# EAGLE schematic serv_open8_rohm (EAGLE 9.6.2)
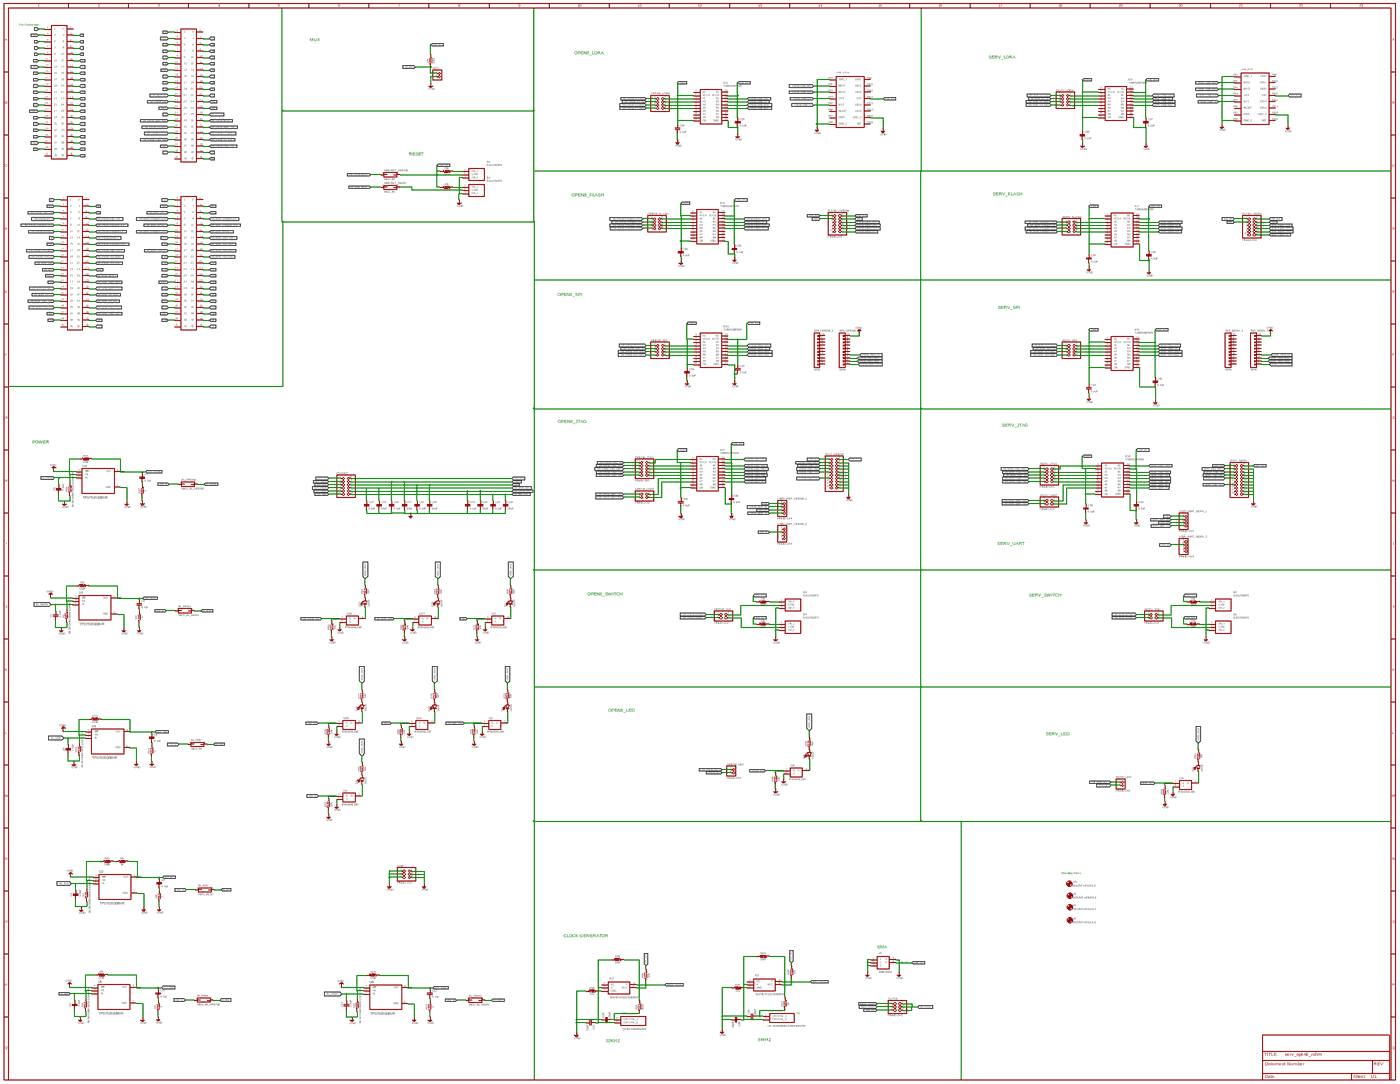
[diagram p0: schematic, sheet 1, overview]
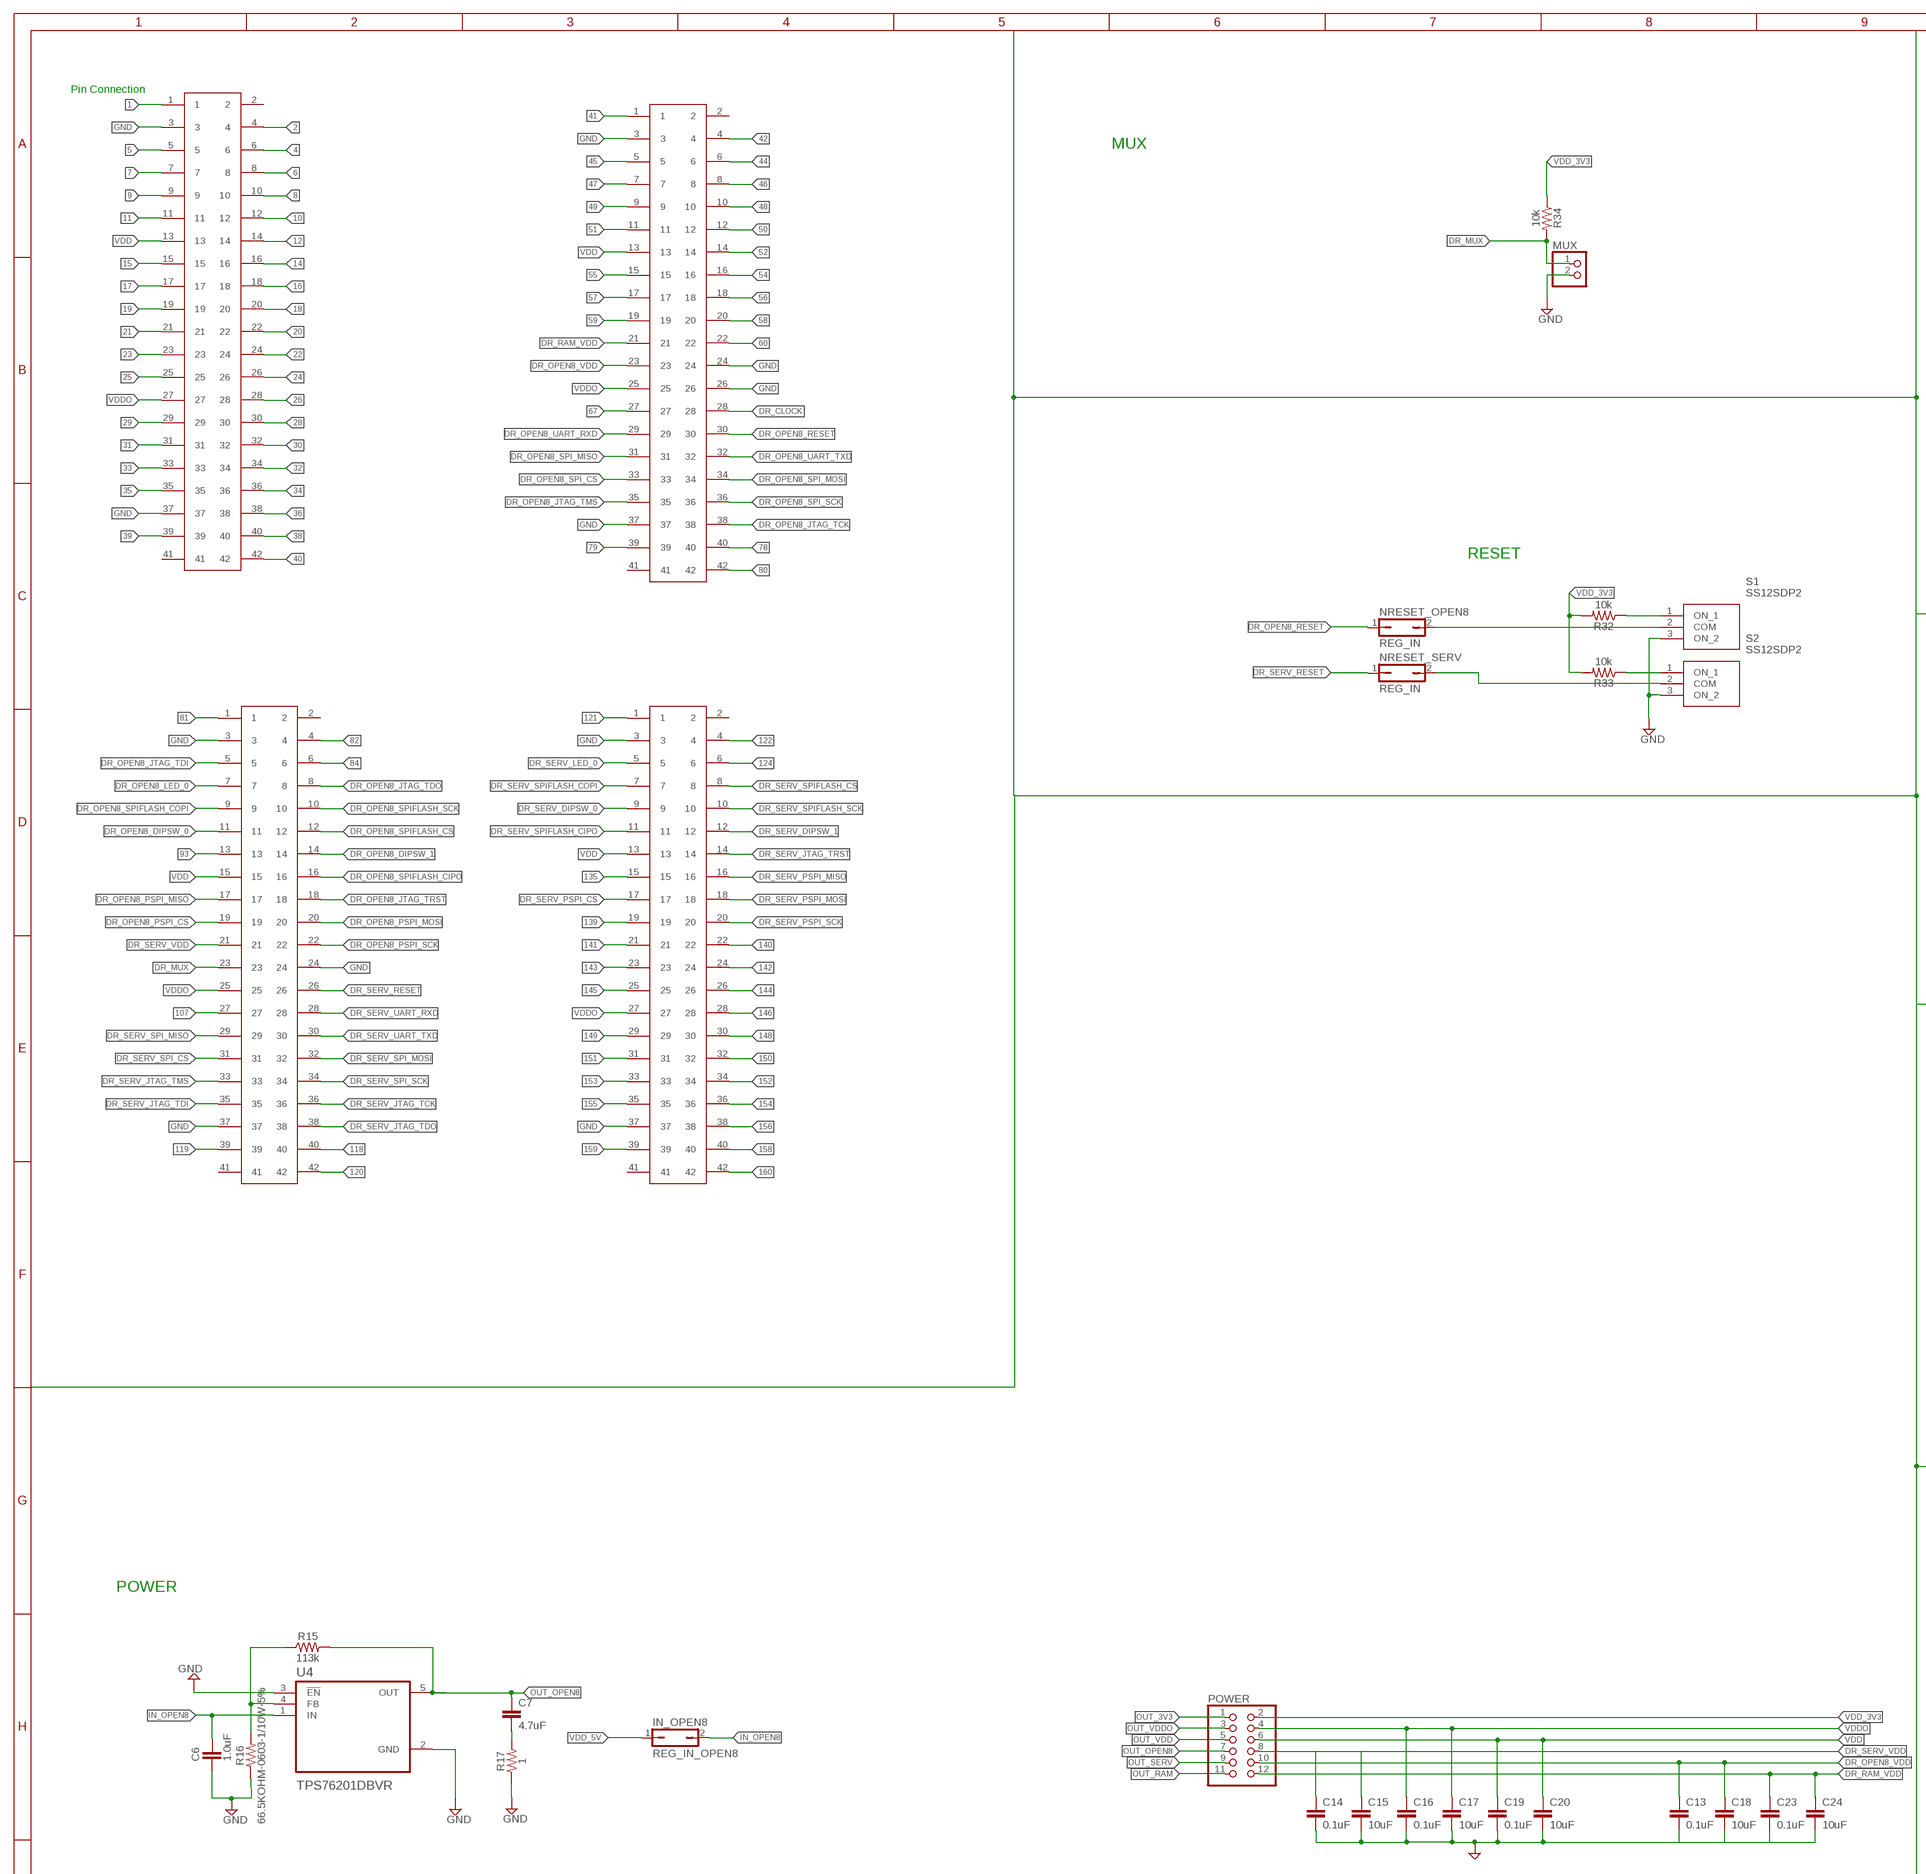
[diagram p1: schematic, sheet 1, part 1 of 6]
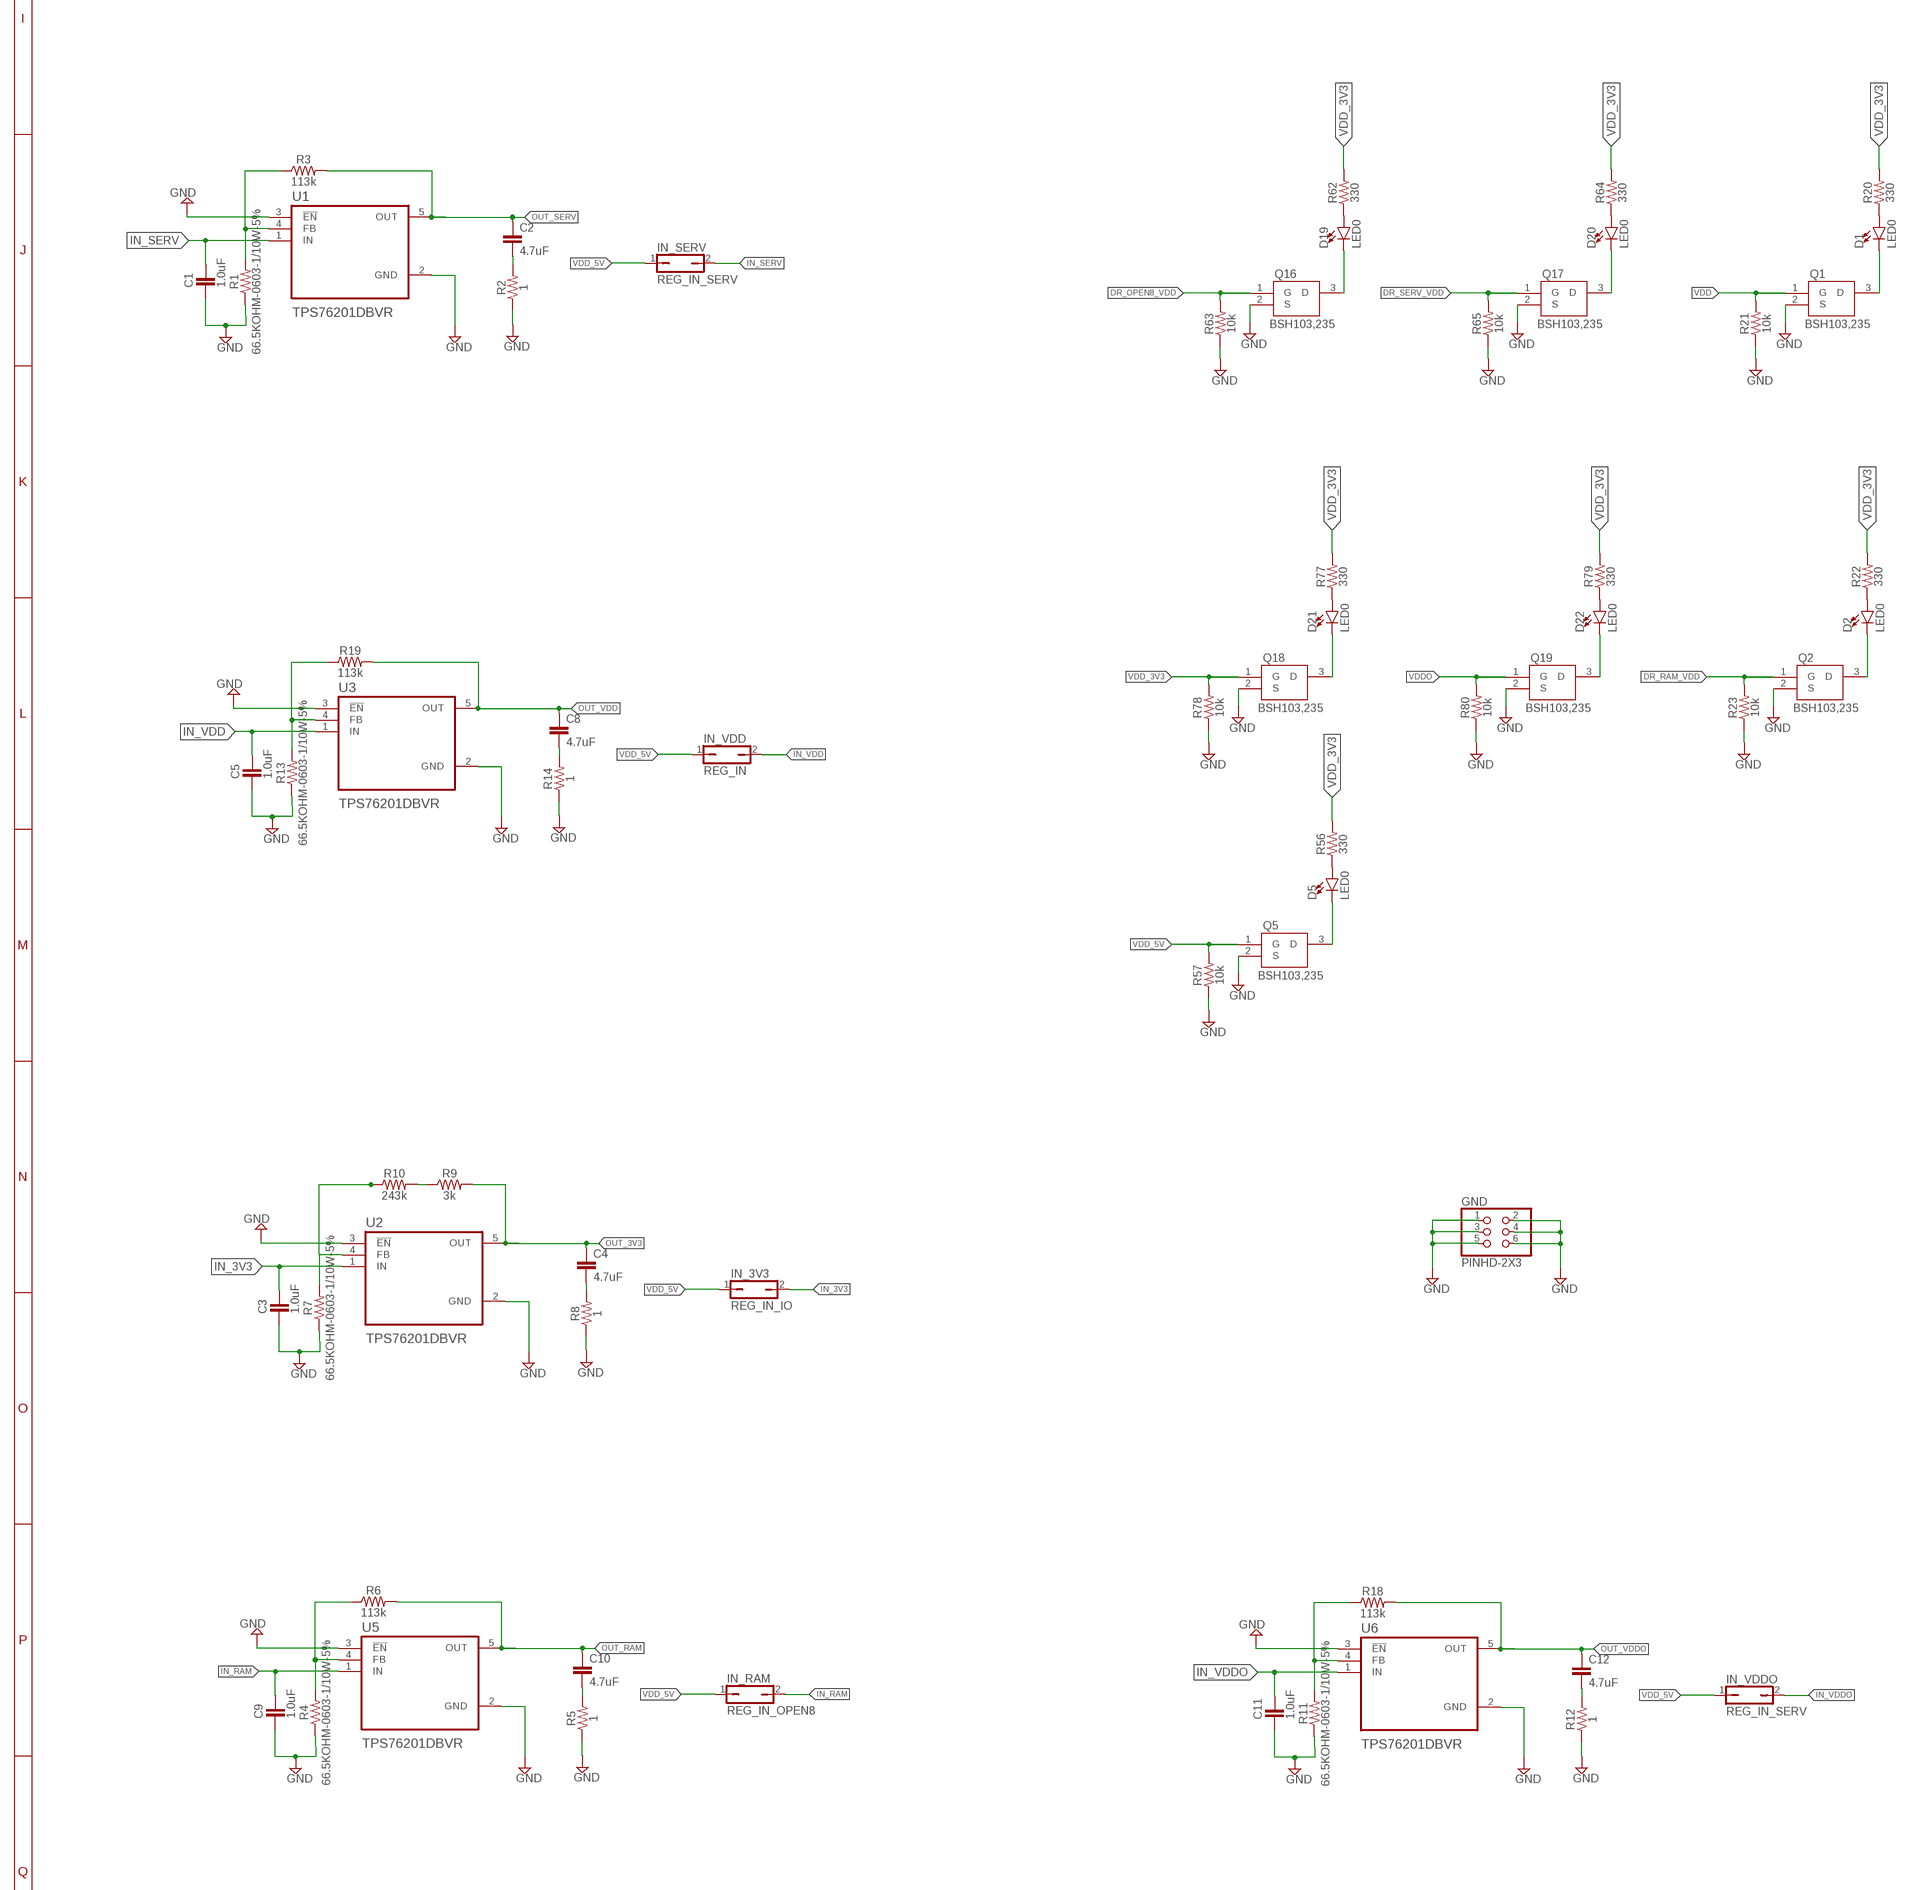
[diagram p2: schematic, sheet 1, part 2 of 6]
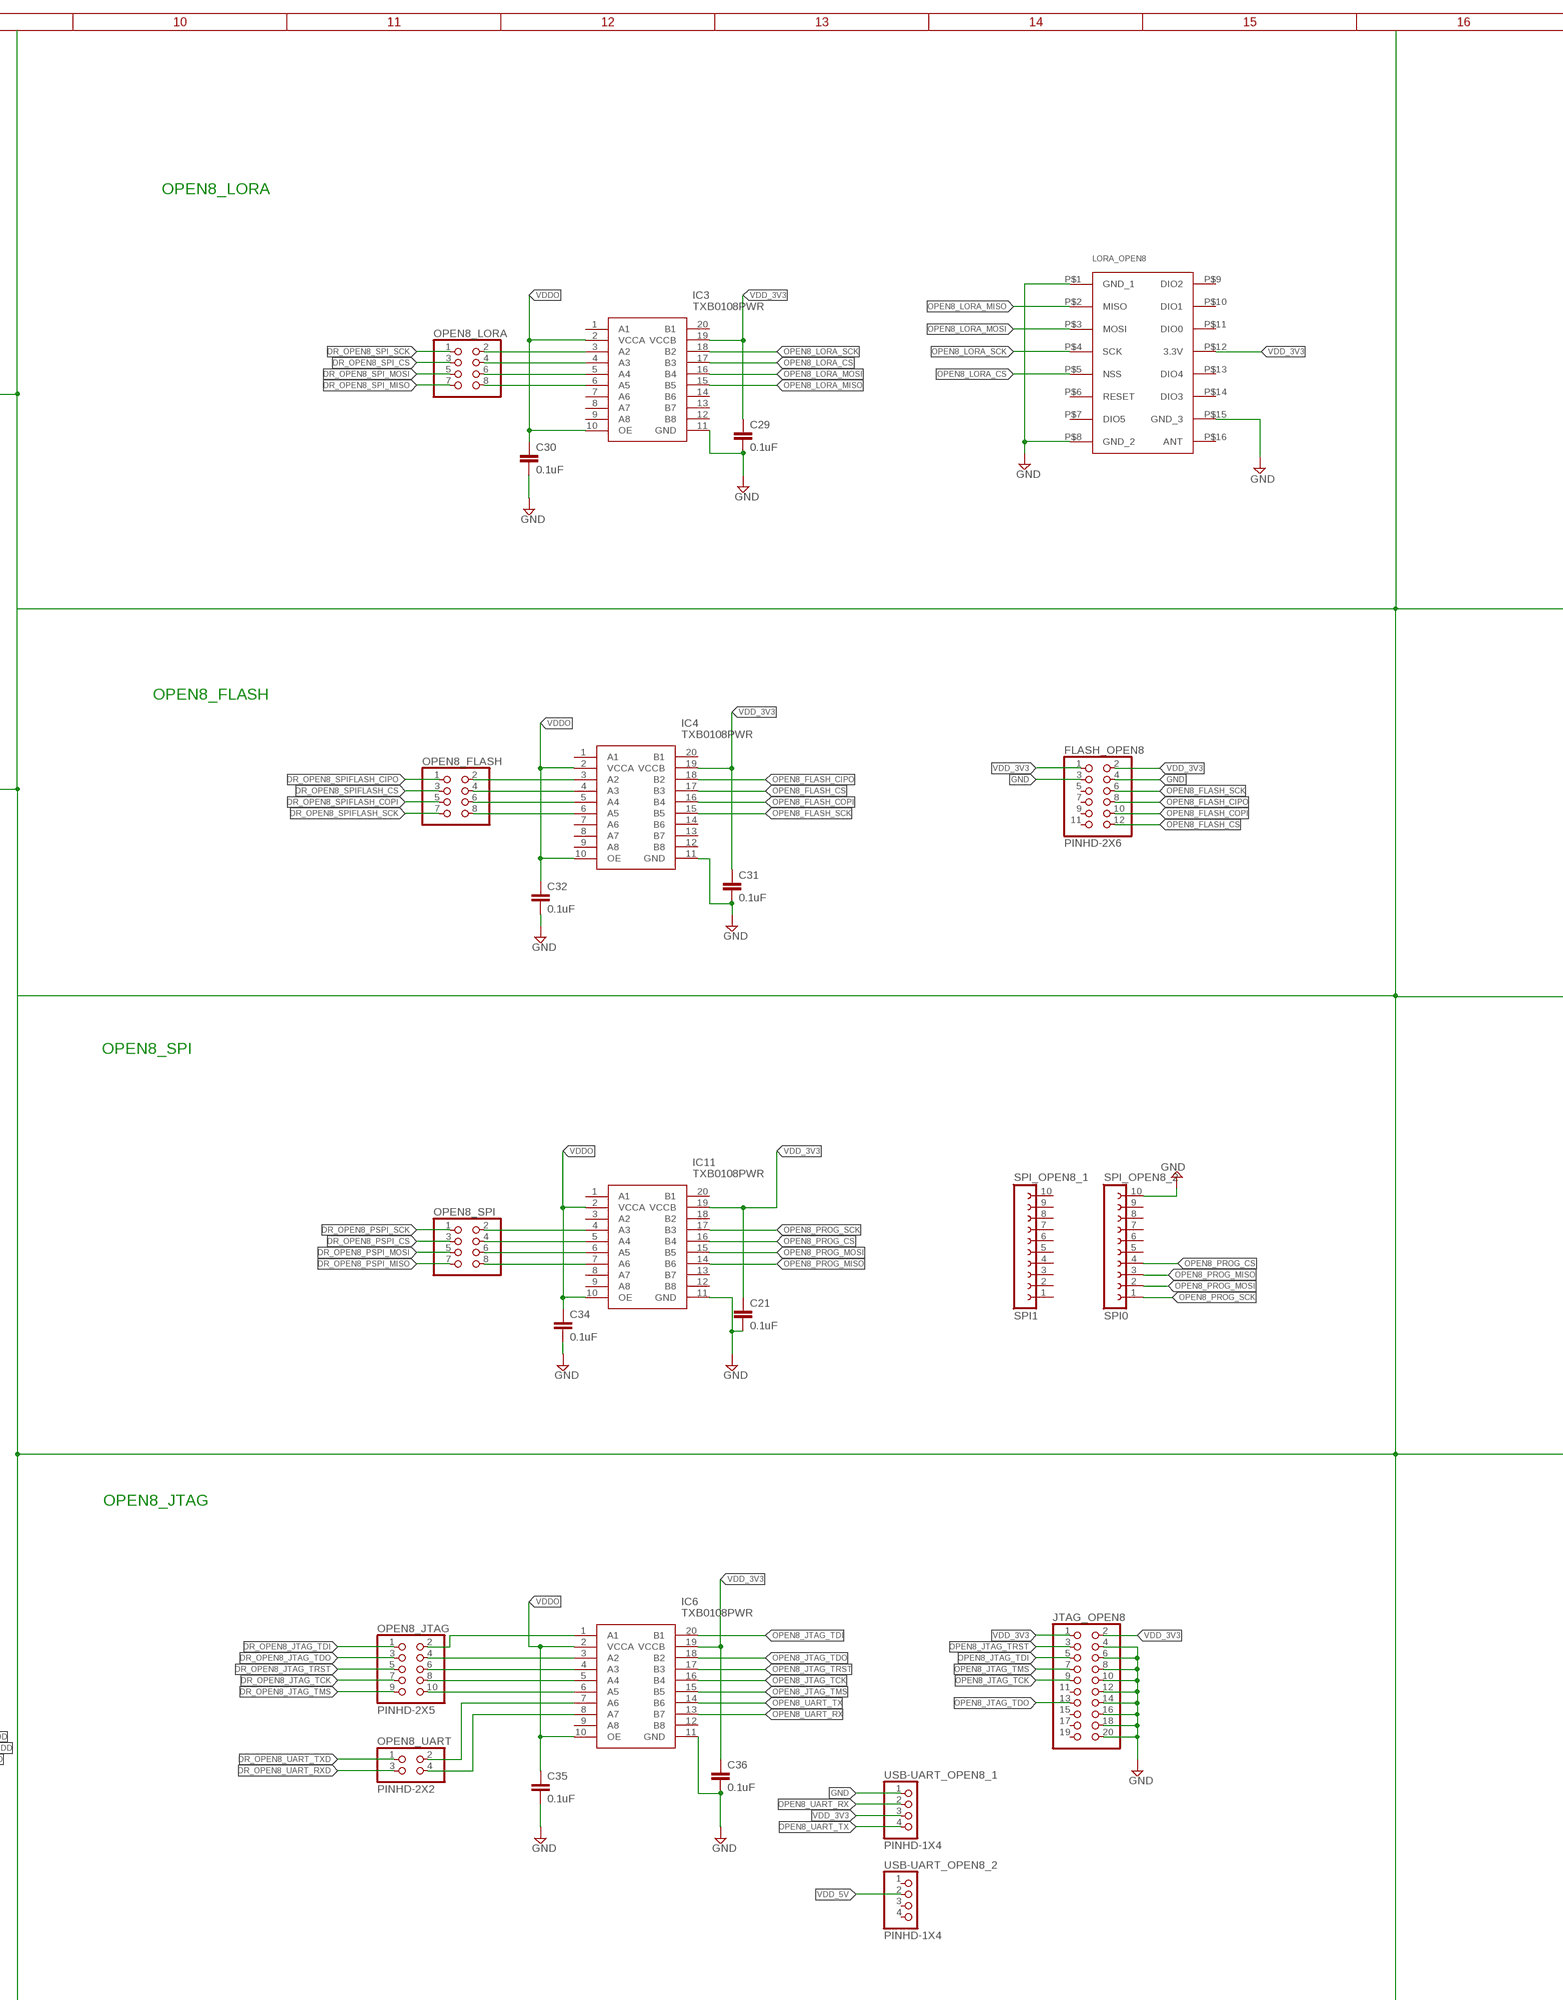
[diagram p3: schematic, sheet 1, part 3 of 6]
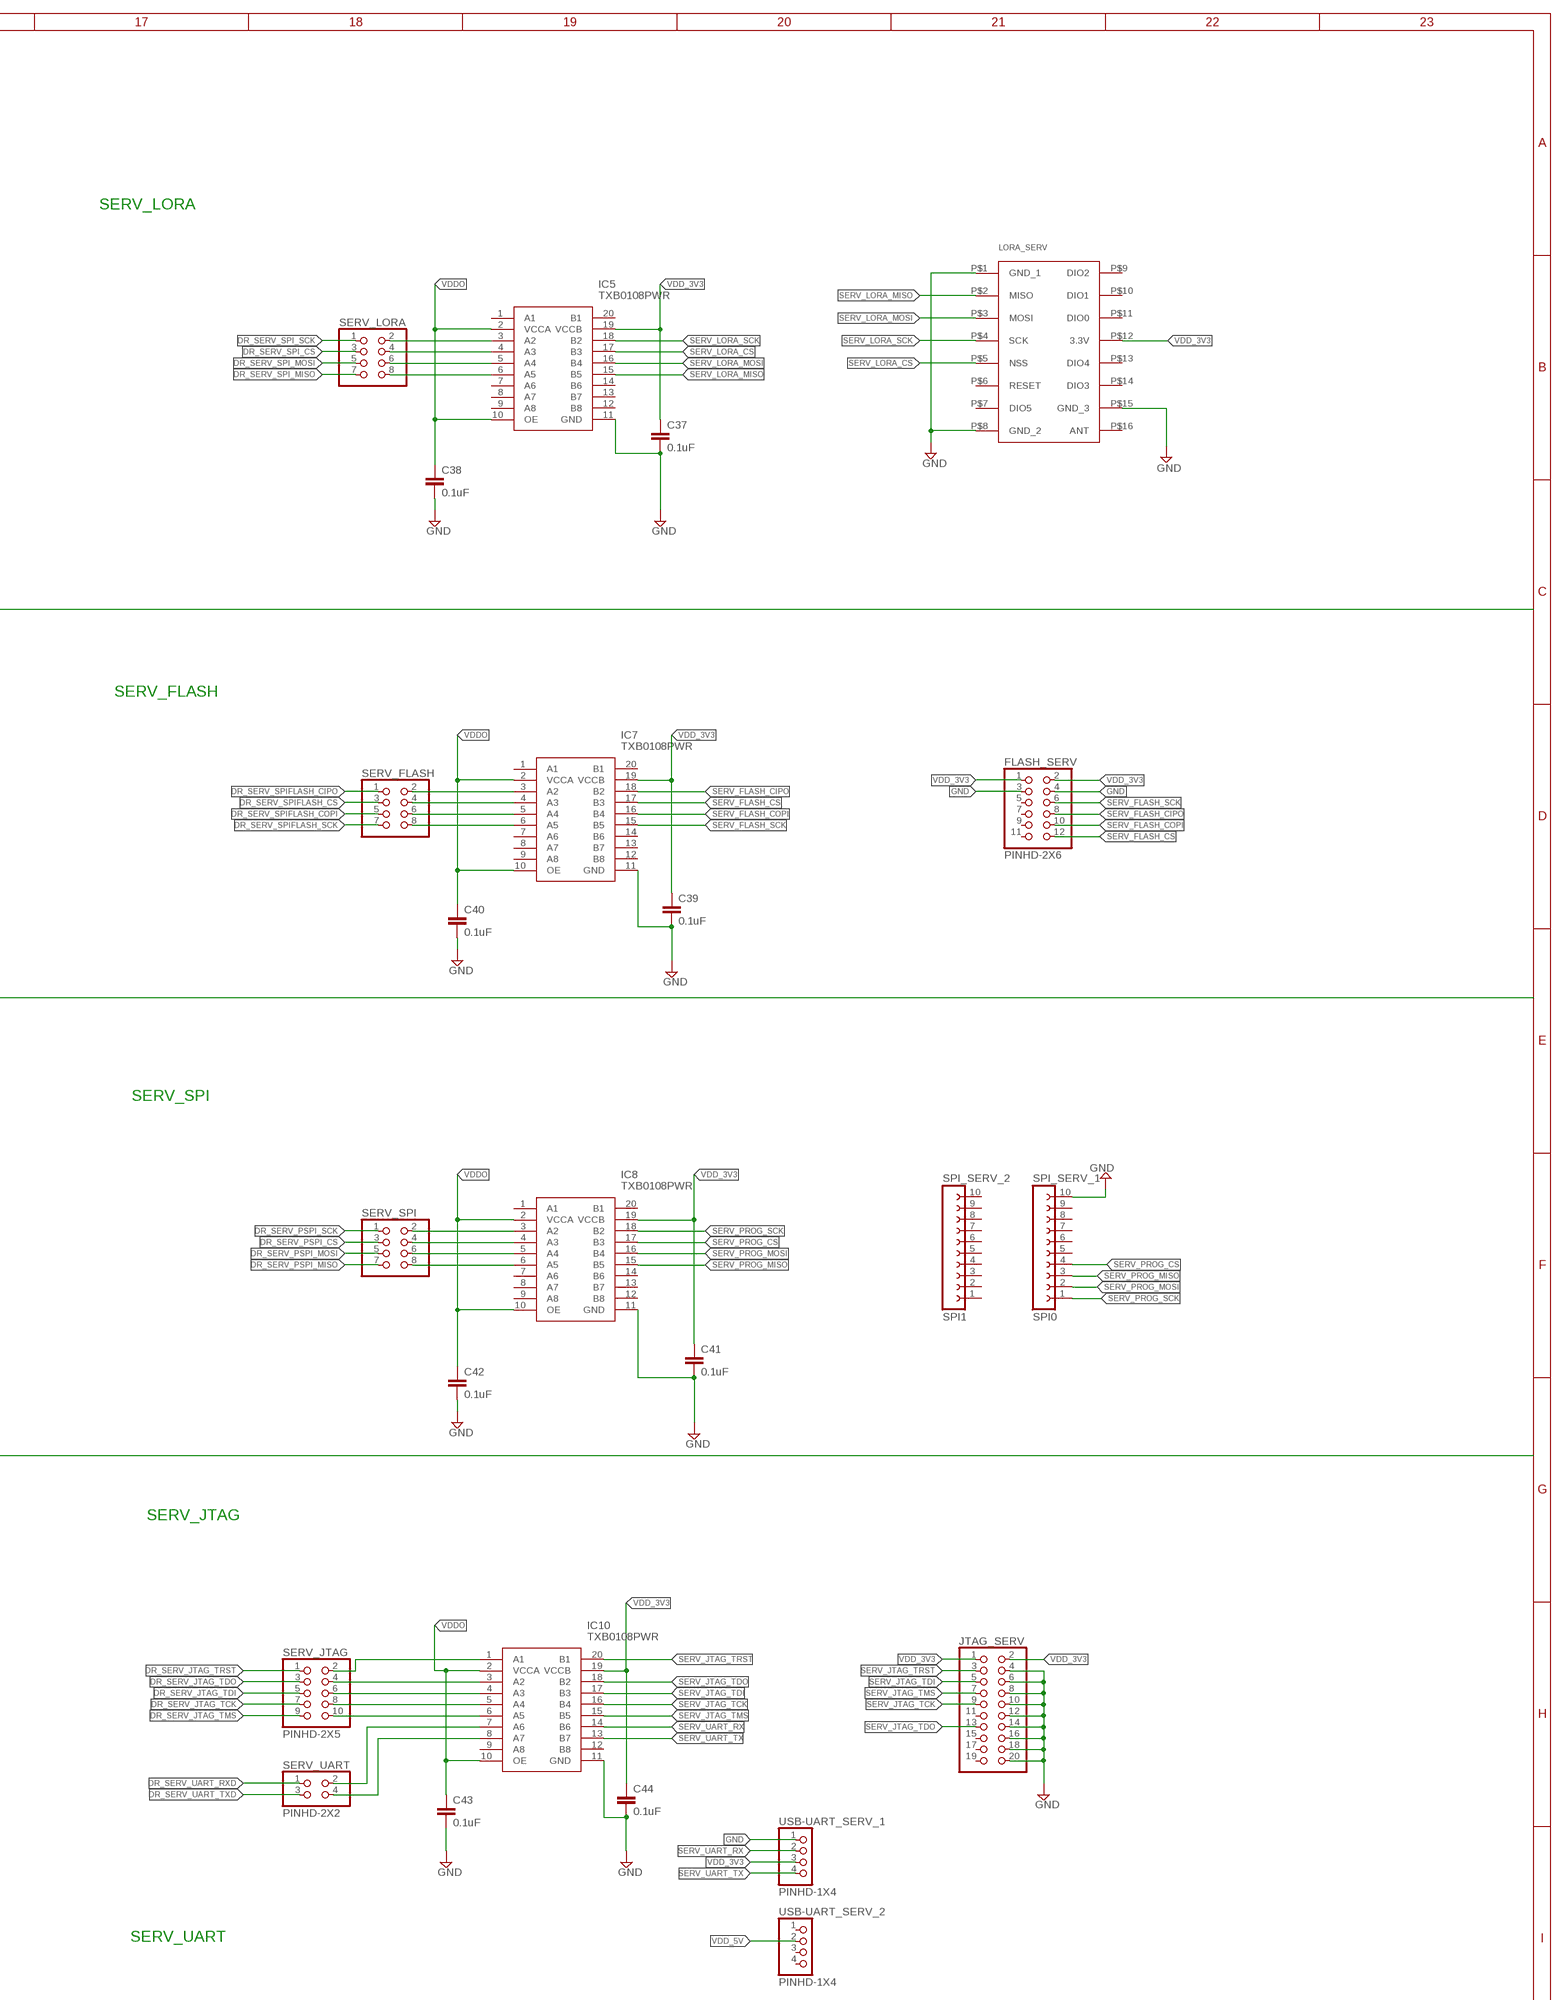
[diagram p4: schematic, sheet 1, part 4 of 6]
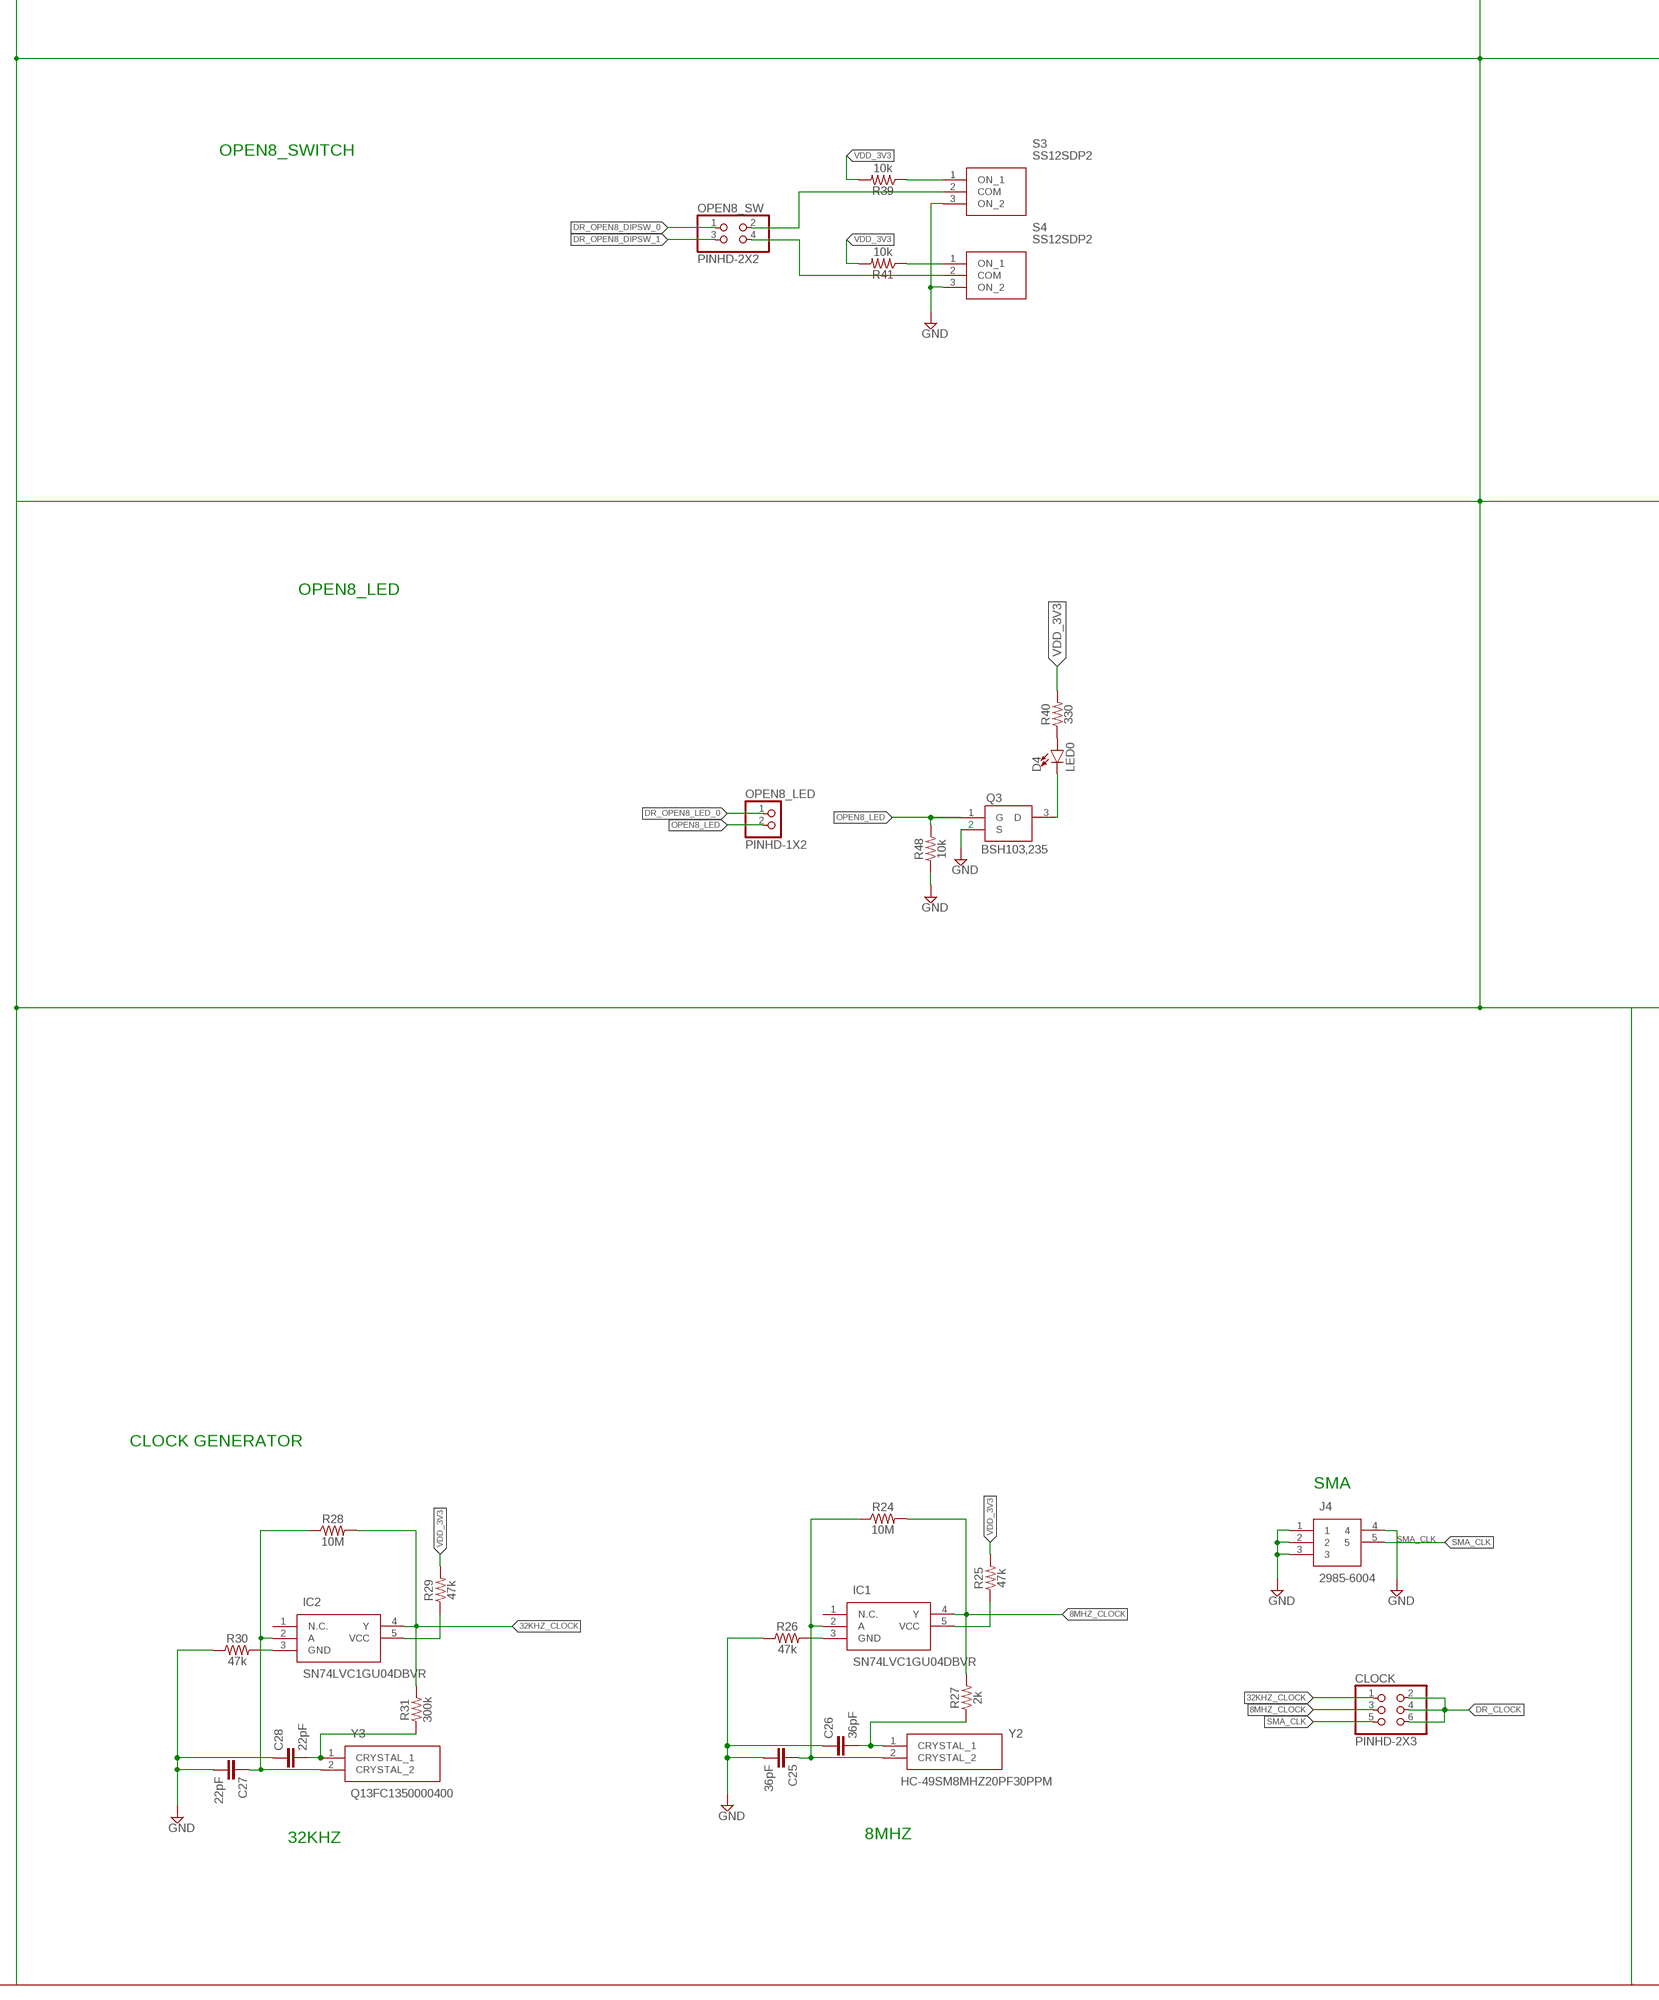
[diagram p5: schematic, sheet 1, part 5 of 6]
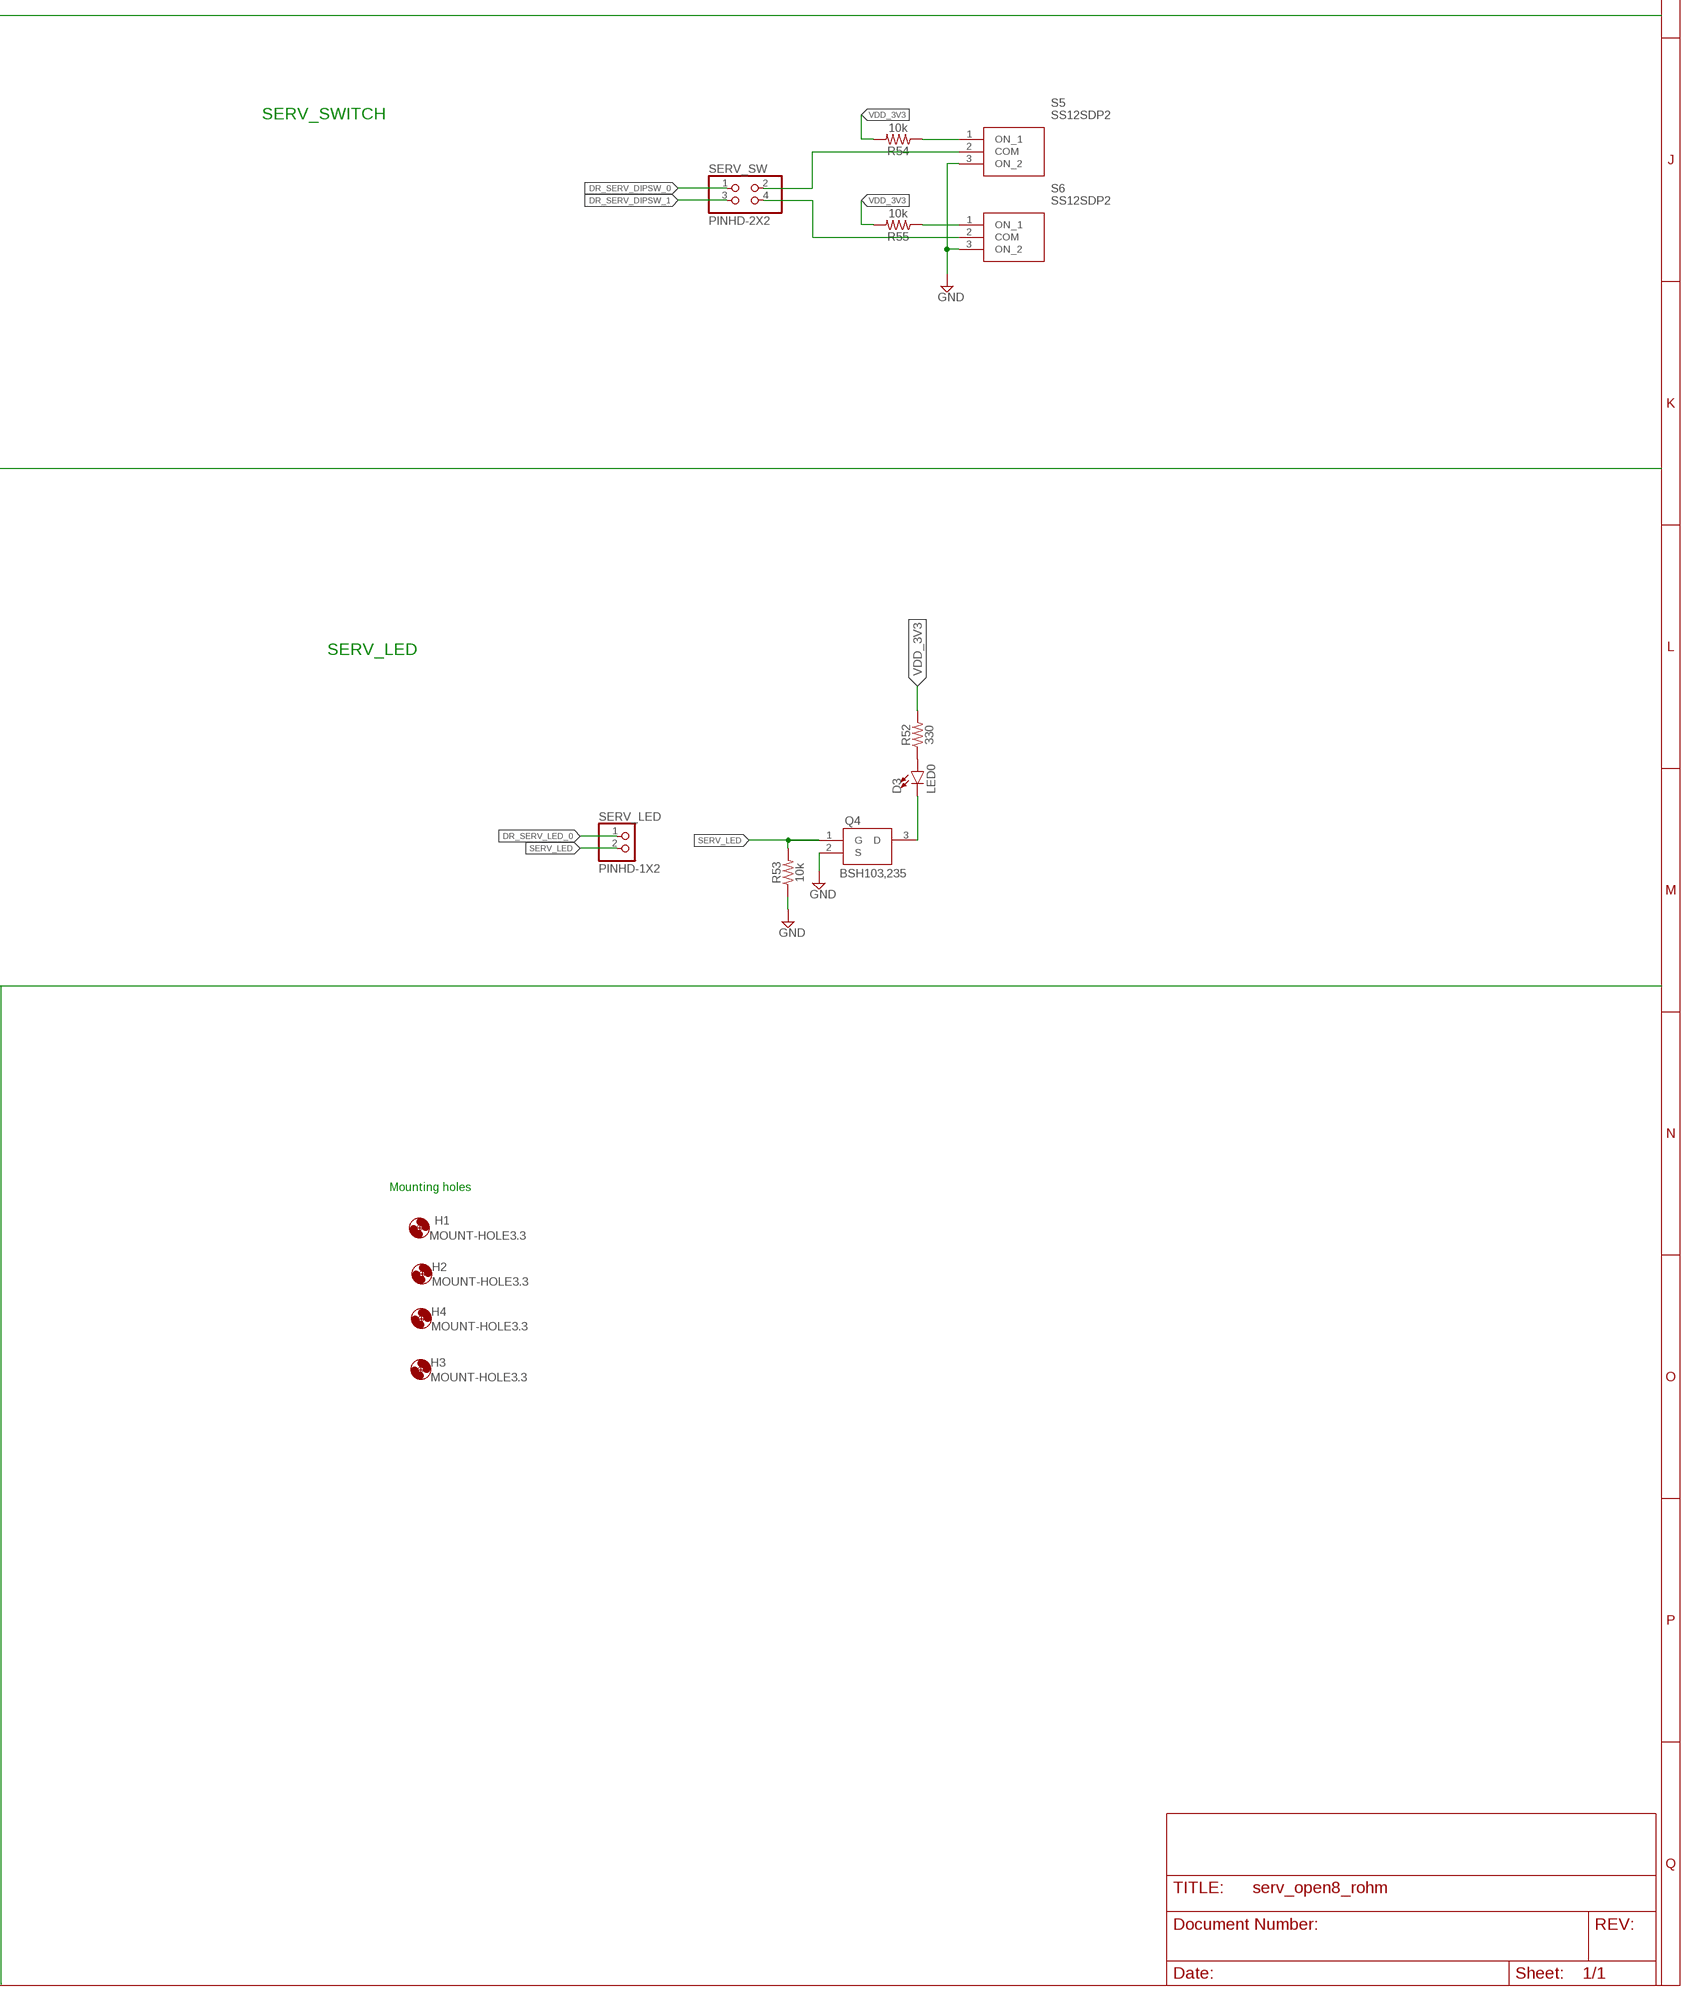
[diagram p6: schematic, sheet 1, part 6 of 6]

## Parts
C1  1.0uF  1.0UF-0603-16V-10%  [0603]
C2  4.7uF  4.7UF0603  [0603]
C3  1.0uF  1.0UF-0603-16V-10%  [0603]
C4  4.7uF  4.7UF0603  [0603]
C5  1.0uF  1.0UF-0603-16V-10%  [0603]
C6  1.0uF  1.0UF-0603-16V-10%  [0603]
C7  4.7uF  4.7UF0603  [0603]
C8  4.7uF  4.7UF0603  [0603]
C9  1.0uF  1.0UF-0603-16V-10%  [0603]
C10  4.7uF  4.7UF0603  [0603]
C11  1.0uF  1.0UF-0603-16V-10%  [0603]
C12  4.7uF  4.7UF0603  [0603]
C13  0.1uF  0.1UF-0603-25V-5%  [0603]
C14  0.1uF  0.1UF-0603-25V-5%  [0603]
C15  10uF  10UF-0603-6.3V-20%  [0603]
C16  0.1uF  0.1UF-0603-25V-5%  [0603]
C17  10uF  10UF-0603-6.3V-20%  [0603]
C18  10uF  10UF-0603-6.3V-20%  [0603]
C19  0.1uF  0.1UF-0603-25V-5%  [0603]
C20  10uF  10UF-0603-6.3V-20%  [0603]
C21  0.1uF  0.1UF-0603-25V-5%  [0603]
C23  0.1uF  0.1UF-0603-25V-5%  [0603]
C24  10uF  10UF-0603-6.3V-20%  [0603]
C25  36pF  22PF-0603-50V-5%  [0603]
C26  36pF  22PF-0603-50V-5%  [0603]
C27  22pF  22PF-0603-50V-5%  [0603]
C28  22pF  22PF-0603-50V-5%  [0603]
C29  0.1uF  0.1UF-0603-25V-5%  [0603]
C30  0.1uF  0.1UF-0603-25V-5%  [0603]
C31  0.1uF  0.1UF-0603-25V-5%  [0603]
C32  0.1uF  0.1UF-0603-25V-5%  [0603]
C34  0.1uF  0.1UF-0603-25V-5%  [0603]
C35  0.1uF  0.1UF-0603-25V-5%  [0603]
C36  0.1uF  0.1UF-0603-25V-5%  [0603]
C37  0.1uF  0.1UF-0603-25V-5%  [0603]
C38  0.1uF  0.1UF-0603-25V-5%  [0603]
C39  0.1uF  0.1UF-0603-25V-5%  [0603]
C40  0.1uF  0.1UF-0603-25V-5%  [0603]
C41  0.1uF  0.1UF-0603-25V-5%  [0603]
C42  0.1uF  0.1UF-0603-25V-5%  [0603]
C43  0.1uF  0.1UF-0603-25V-5%  [0603]
C44  0.1uF  0.1UF-0603-25V-5%  [0603]
CLOCK  PINHD-2X3  [2X03]
D1  LED0  LED0603  [LED-0603]
D2  LED0  LED0603  [LED-0603]
D3  LED0  LED0603  [LED-0603]
D4  LED0  LED0603  [LED-0603]
D5  LED0  LED0603  [LED-0603]
D19  LED0  LED0603  [LED-0603]
D20  LED0  LED0603  [LED-0603]
D21  LED0  LED0603  [LED-0603]
D22  LED0  LED0603  [LED-0603]
FLASH_OPEN8  PINHD-2X6  [2X06]
FLASH_SERV  PINHD-2X6  [2X06]
GND  PINHD-2X3  [2X03]
H1  MOUNT-HOLE3.3  [3,3]
H2  MOUNT-HOLE3.3  [3,3]
H3  MOUNT-HOLE3.3  [3,3]
H4  MOUNT-HOLE3.3  [3,3]
IC1  SN74LVC1GU04DBVR  [SOT95P280X145-5N]
IC2  SN74LVC1GU04DBVR  [SOT95P280X145-5N]
IC3  TXB0108PWR  [SOP65P640X120-20N]
IC4  TXB0108PWR  [SOP65P640X120-20N]
IC5  TXB0108PWR  [SOP65P640X120-20N]
IC6  TXB0108PWR  [SOP65P640X120-20N]
IC7  TXB0108PWR  [SOP65P640X120-20N]
IC8  TXB0108PWR  [SOP65P640X120-20N]
IC10  TXB0108PWR  [SOP65P640X120-20N]
IC11  TXB0108PWR  [SOP65P640X120-20N]
IN_3V3  REG_IN_IO  JP1Q  [JP1]
IN_OPEN8  REG_IN_OPEN8  JP1Q  [JP1]
IN_RAM  REG_IN_OPEN8  JP1Q  [JP1]
IN_SERV  REG_IN_SERV  JP1Q  [JP1]
IN_VDD  REG_IN  JP1Q  [JP1]
IN_VDDO  REG_IN_SERV  JP1Q  [JP1]
J4  2985-6004  [29856004]
JTAG_OPEN8  PINHD-2X10  [2X10]
JTAG_SERV  PINHD-2X10  [2X10]
LORA_OPEN8  RFM95W-915S2  [RFM95-915S2]
LORA_SERV  RFM95W-915S2  [RFM95-915S2]
MUX  PINHD-1X2  [1X02]
NRESET_OPEN8  REG_IN  JP1Q  [JP1]
NRESET_SERV  REG_IN  JP1Q  [JP1]
OPEN8_FLASH  PINHD-2X4  [2X04]
OPEN8_JTAG  PINHD-2X5  [2X05]
OPEN8_LED  PINHD-1X2  [1X02]
OPEN8_LORA  PINHD-2X4  [2X04]
OPEN8_SPI  PINHD-2X4  [2X04]
OPEN8_SW  PINHD-2X2  [2X02]
OPEN8_UART  PINHD-2X2  [2X02]
POWER  PINHD-2X6  [2X06]
Q1  BSH103,235  [SOT95P230X110-3N]
Q2  BSH103,235  [SOT95P230X110-3N]
Q3  BSH103,235  [SOT95P230X110-3N]
Q4  BSH103,235  [SOT95P230X110-3N]
Q5  BSH103,235  [SOT95P230X110-3N]
Q16  BSH103,235  [SOT95P230X110-3N]
Q17  BSH103,235  [SOT95P230X110-3N]
Q18  BSH103,235  [SOT95P230X110-3N]
Q19  BSH103,235  [SOT95P230X110-3N]
R1  66.5KOHM-0603-1/10W-5%  62KOHM-0603-1/10W-5%  [0603]
R2  1  1OHM-0603-1/10W-1%  [0603]
R3  113k  43KOHM-0603-1/10W-1%  [0603]
R4  66.5KOHM-0603-1/10W-5%  62KOHM-0603-1/10W-5%  [0603]
R5  1  1OHM-0603-1/10W-1%  [0603]
R6  113k  43KOHM-0603-1/10W-1%  [0603]
R7  66.5KOHM-0603-1/10W-5%  62KOHM-0603-1/10W-5%  [0603]
R8  1  1OHM-0603-1/10W-1%  [0603]
R9  3k  26.7KOHM0603-1/10W-1%  [0603]
R10  243k  220KOHM-0603-1/10W-1%  [0603]
R11  66.5KOHM-0603-1/10W-5%  62KOHM-0603-1/10W-5%  [0603]
R12  1  1OHM-0603-1/10W-1%  [0603]
R13  66.5KOHM-0603-1/10W-5%  62KOHM-0603-1/10W-5%  [0603]
R14  1  1OHM-0603-1/10W-1%  [0603]
R15  113k  43KOHM-0603-1/10W-1%  [0603]
R16  66.5KOHM-0603-1/10W-5%  62KOHM-0603-1/10W-5%  [0603]
R17  1  1OHM-0603-1/10W-1%  [0603]
R18  113k  43KOHM-0603-1/10W-1%  [0603]
R19  113k  43KOHM-0603-1/10W-1%  [0603]
R20  330  330OHM-0603-1/10W-1%  [0603]
R21  10k  10KOHM-0603-1/10W-1%  [0603]
R22  330  330OHM-0603-1/10W-1%  [0603]
R23  10k  10KOHM-0603-1/10W-1%  [0603]
R24  10M  22MOHM-0603-1/10W-10%  [0603]
R25  47k  22MOHM-0603-1/10W-10%  [0603]
R26  47k  22MOHM-0603-1/10W-10%  [0603]
R27  2k  22MOHM-0603-1/10W-10%  [0603]
R28  10M  22MOHM-0603-1/10W-10%  [0603]
R29  47k  22MOHM-0603-1/10W-10%  [0603]
R30  47k  22MOHM-0603-1/10W-10%  [0603]
R31  300k  22MOHM-0603-1/10W-10%  [0603]
R32  10k  10KOHM-0603-1/10W-1%  [0603]
R33  10k  10KOHM-0603-1/10W-1%  [0603]
R34  10k  10KOHM-0603-1/10W-1%  [0603]
R39  10k  10KOHM-0603-1/10W-1%  [0603]
R40  330  330OHM-0603-1/10W-1%  [0603]
R41  10k  10KOHM-0603-1/10W-1%  [0603]
R48  10k  10KOHM-0603-1/10W-1%  [0603]
R52  330  330OHM-0603-1/10W-1%  [0603]
R53  10k  10KOHM-0603-1/10W-1%  [0603]
R54  10k  10KOHM-0603-1/10W-1%  [0603]
R55  10k  10KOHM-0603-1/10W-1%  [0603]
R56  330  330OHM-0603-1/10W-1%  [0603]
R57  10k  10KOHM-0603-1/10W-1%  [0603]
R62  330  330OHM-0603-1/10W-1%  [0603]
R63  10k  10KOHM-0603-1/10W-1%  [0603]
R64  330  330OHM-0603-1/10W-1%  [0603]
R65  10k  10KOHM-0603-1/10W-1%  [0603]
R77  330  330OHM-0603-1/10W-1%  [0603]
R78  10k  10KOHM-0603-1/10W-1%  [0603]
R79  330  330OHM-0603-1/10W-1%  [0603]
R80  10k  10KOHM-0603-1/10W-1%  [0603]
S1  SS12SDP2  [SS12SDP2]
S2  SS12SDP2  [SS12SDP2]
S3  SS12SDP2  [SS12SDP2]
S4  SS12SDP2  [SS12SDP2]
S5  SS12SDP2  [SS12SDP2]
S6  SS12SDP2  [SS12SDP2]
SERV_FLASH  PINHD-2X4  [2X04]
SERV_JTAG  PINHD-2X5  [2X05]
SERV_LED  PINHD-1X2  [1X02]
SERV_LORA  PINHD-2X4  [2X04]
SERV_SPI  PINHD-2X4  [2X04]
SERV_SW  PINHD-2X2  [2X02]
SERV_UART  PINHD-2X2  [2X02]
SPI_OPEN8_1  SPI1  FE10-1  [FE10]
SPI_OPEN8_2  SPI0  FE10-1  [FE10]
SPI_SERV_1  SPI0  FE10-1  [FE10]
SPI_SERV_2  SPI1  FE10-1  [FE10]
U1  TPS76201DBVR  [SOT95P280X145-5N]
U2  TPS76201DBVR  [SOT95P280X145-5N]
U3  TPS76201DBVR  [SOT95P280X145-5N]
U4  TPS76201DBVR  [SOT95P280X145-5N]
U5  TPS76201DBVR  [SOT95P280X145-5N]
U6  TPS76201DBVR  [SOT95P280X145-5N]
U$1  2X41_HEADER  [2X41_HEADER]
U$2  2X41_HEADER  [2X41_HEADER]
U$3  2X41_HEADER  [2X41_HEADER]
U$4  2X41_HEADER  [2X41_HEADER]
USB-UART_OPEN8_1  PINHD-1X4  [1X04]
USB-UART_OPEN8_2  PINHD-1X4  [1X04]
USB-UART_SERV_1  PINHD-1X4  [1X04]
USB-UART_SERV_2  PINHD-1X4  [1X04]
Y2  HC-49SM8MHZ20PF30PPM  [HC49SM8MHZ20PF30PPM]
Y3  Q13FC1350000400  [Q13FC1350000400]

## Nets
1: U$1.1
2: U$1.4
4: U$1.6
5: U$1.5
6: U$1.8
7: U$1.7
8: U$1.10
8MHZ_CLOCK: CLOCK.3 IC1.4(Y) R24.2 R27.2
9: U$1.9
10: U$1.12
11: U$1.11
12: U$1.14
14: U$1.16
15: U$1.15
16: U$1.18
17: U$1.17
18: U$1.20
19: U$1.19
20: U$1.22
21: U$1.21
22: U$1.24
23: U$1.23
24: U$1.26
25: U$1.25
26: U$1.28
28: U$1.30
29: U$1.29
30: U$1.32
31: U$1.31
32: U$1.34
32KHZ_CLOCK: CLOCK.1 IC2.4(Y) R28.2 R31.2
33: U$1.33
34: U$1.36
35: U$1.35
36: U$1.38
38: U$1.40
39: U$1.39
40: U$1.42
41: U$2.1
42: U$2.4
44: U$2.6
45: U$2.5
46: U$2.8
47: U$2.7
48: U$2.10
49: U$2.9
50: U$2.12
51: U$2.11
52: U$2.14
54: U$2.16
55: U$2.15
56: U$2.18
57: U$2.17
58: U$2.20
59: U$2.19
60: U$2.22
67: U$2.27
78: U$2.40
79: U$2.39
80: U$2.42
81: U$3.1
82: U$3.4
84: U$3.6
93: U$3.13
107: U$3.27
118: U$3.40
119: U$3.39
120: U$3.42
121: U$4.1
122: U$4.4
124: U$4.6
135: U$4.15
139: U$4.19
140: U$4.22
141: U$4.21
142: U$4.24
143: U$4.23
144: U$4.26
145: U$4.25
146: U$4.28
148: U$4.30
149: U$4.29
150: U$4.32
151: U$4.31
152: U$4.34
153: U$4.33
154: U$4.36
155: U$4.35
156: U$4.38
158: U$4.40
159: U$4.39
160: U$4.42
DR_CLOCK: CLOCK.2 CLOCK.4 CLOCK.6 U$2.28
DR_MUX: MUX.1 R34.2 U$3.23
DR_OPEN8_DIPSW_0: OPEN8_SW.1 U$3.11
DR_OPEN8_DIPSW_1: OPEN8_SW.3 U$3.14
DR_OPEN8_JTAG_TCK: OPEN8_JTAG.7 U$2.38
DR_OPEN8_JTAG_TDI: OPEN8_JTAG.1 U$3.5
DR_OPEN8_JTAG_TDO: OPEN8_JTAG.3 U$3.8
DR_OPEN8_JTAG_TMS: OPEN8_JTAG.9 U$2.35
DR_OPEN8_JTAG_TRST: OPEN8_JTAG.5 U$3.18
DR_OPEN8_LED_0: OPEN8_LED.1 U$3.7
DR_OPEN8_PSPI_CS: OPEN8_SPI.3 U$3.19
DR_OPEN8_PSPI_MISO: OPEN8_SPI.7 U$3.17
DR_OPEN8_PSPI_MOSI: OPEN8_SPI.5 U$3.20
DR_OPEN8_PSPI_SCK: OPEN8_SPI.1 U$3.22
DR_OPEN8_RESET: NRESET_OPEN8.1 U$2.30
DR_OPEN8_SPI_CS: OPEN8_LORA.3 U$2.33
DR_OPEN8_SPI_MISO: OPEN8_LORA.7 U$2.31
DR_OPEN8_SPI_MOSI: OPEN8_LORA.5 U$2.34
DR_OPEN8_SPI_SCK: OPEN8_LORA.1 U$2.36
DR_OPEN8_SPIFLASH_CIPO: OPEN8_FLASH.1 U$3.16
DR_OPEN8_SPIFLASH_COPI: OPEN8_FLASH.5 U$3.9
DR_OPEN8_SPIFLASH_CS: OPEN8_FLASH.3 U$3.12
DR_OPEN8_SPIFLASH_SCK: OPEN8_FLASH.7 U$3.10
DR_OPEN8_UART_RXD: OPEN8_UART.3 U$2.29
DR_OPEN8_UART_TXD: OPEN8_UART.1 U$2.32
DR_OPEN8_VDD: C13.1 C18.1 POWER.10 Q16.1(G) R63.2 U$2.23
DR_RAM_VDD: C23.1 C24.1 POWER.12 Q2.1(G) R23.2 U$2.21
DR_SERV_DIPSW_0: SERV_SW.1 U$4.9
DR_SERV_DIPSW_1: SERV_SW.3 U$4.12
DR_SERV_JTAG_TCK: SERV_JTAG.7 U$3.36
DR_SERV_JTAG_TDI: SERV_JTAG.5 U$3.35
DR_SERV_JTAG_TDO: SERV_JTAG.3 U$3.38
DR_SERV_JTAG_TMS: SERV_JTAG.9 U$3.33
DR_SERV_JTAG_TRST: SERV_JTAG.1 U$4.14
DR_SERV_LED_0: SERV_LED.1 U$4.5
DR_SERV_PSPI_CS: SERV_SPI.3 U$4.17
DR_SERV_PSPI_MISO: SERV_SPI.7 U$4.16
DR_SERV_PSPI_MOSI: SERV_SPI.5 U$4.18
DR_SERV_PSPI_SCK: SERV_SPI.1 U$4.20
DR_SERV_RESET: NRESET_SERV.1 U$3.26
DR_SERV_SPI_CS: SERV_LORA.3 U$3.31
DR_SERV_SPI_MISO: SERV_LORA.7 U$3.29
DR_SERV_SPI_MOSI: SERV_LORA.5 U$3.32
DR_SERV_SPI_SCK: SERV_LORA.1 U$3.34
DR_SERV_SPIFLASH_CIPO: SERV_FLASH.1 U$4.11
DR_SERV_SPIFLASH_COPI: SERV_FLASH.5 U$4.7
DR_SERV_SPIFLASH_CS: SERV_FLASH.3 U$4.8
DR_SERV_SPIFLASH_SCK: SERV_FLASH.7 U$4.10
DR_SERV_UART_RXD: SERV_UART.1 U$3.28
DR_SERV_UART_TXD: SERV_UART.3 U$3.30
DR_SERV_VDD: C14.1 C15.1 POWER.8 Q17.1(G) R65.2 U$3.21
GND: C1.2 C3.2 C5.2 C6.2 C9.2 C11.2 C13.2 C14.2 C15.2 C16.2 C17.2 C18.2 C19.2 C20.2 C21.2 C23.2 C24.2 C25.2 C26.1 C27.2 C28.1 C29.2 C30.2 C31.2 C32.2 C34.2 C35.2 C36.2 C37.2 C38.2 C39.2 C40.2 C41.2 C42.2 C43.2 C44.2 FLASH_OPEN8.3 FLASH_OPEN8.4 FLASH_SERV.3 FLASH_SERV.4 GND.1 GND.2 GND.3 GND.4 GND.5 GND.6 IC3.11(GND) IC4.11(GND) IC5.11(GND) IC6.11(GND) IC7.11(GND) IC8.11(GND) IC10.11(GND) IC11.11(GND) J4.1 J4.2 J4.3 J4.4 JTAG_OPEN8.4 JTAG_OPEN8.6 JTAG_OPEN8.8 JTAG_OPEN8.10 JTAG_OPEN8.12 JTAG_OPEN8.14 JTAG_OPEN8.16 JTAG_OPEN8.18 JTAG_OPEN8.20 JTAG_SERV.4 JTAG_SERV.6 JTAG_SERV.8 JTAG_SERV.10 JTAG_SERV.12 JTAG_SERV.14 JTAG_SERV.16 JTAG_SERV.18 JTAG_SERV.20 LORA_OPEN8.P$1(GND_1) LORA_OPEN8.P$8(GND_2) LORA_OPEN8.P$15(GND_3) LORA_SERV.P$1(GND_1) LORA_SERV.P$8(GND_2) LORA_SERV.P$15(GND_3) MUX.2 Q1.2(S) Q2.2(S) Q3.2(S) Q4.2(S) Q5.2(S) Q16.2(S) Q17.2(S) Q18.2(S) Q19.2(S) R1.1 R2.1 R4.1 R5.1 R7.1 R8.1 R11.1 R12.1 R13.1 R14.1 R16.1 R17.1 R21.1 R23.1 R26.1 R30.1 R48.1 R53.1 R57.1 R63.1 R65.1 R78.1 R80.1 S1.3(ON_2) S2.3(ON_2) S3.3(ON_2) S4.3(ON_2) S5.3(ON_2) S6.3(ON_2) SPI_OPEN8_2.10 SPI_SERV_1.10 U1.2(GND) U1.3(!EN) U2.2(GND) U2.3(!EN) U3.2(GND) U3.3(!EN) U4.2(GND) U4.3(!EN) U5.2(GND) U5.3(!EN) U6.2(GND) U6.3(!EN) U$1.3 U$1.37 U$2.3 U$2.24 U$2.26 U$2.37 U$3.3 U$3.24 U$3.37 U$4.3 U$4.37 USB-UART_OPEN8_1.1 USB-UART_SERV_1.1
IN_3V3: C3.1 IN_3V3.2 U2.1(IN)
IN_OPEN8: C6.1 IN_OPEN8.2 U4.1(IN)
IN_RAM: C9.1 IN_RAM.2 U5.1(IN)
IN_SERV: C1.1 IN_SERV.2 U1.1(IN)
IN_VDD: C5.1 IN_VDD.2 U3.1(IN)
IN_VDDO: C11.1 IN_VDDO.2 U6.1(IN)
N$1: R1.2 R3.1 U1.4(FB)
N$2: C2.2 R2.2
N$3: R4.2 R6.1 U5.4(FB)
N$4: C10.2 R5.2
N$5: R11.2 R18.1 U6.4(FB)
N$6: R7.2 R10.1 U2.4(FB)
N$7: C4.2 R8.2
N$8: R9.1 R10.2
N$9: C12.2 R12.2
N$10: D1.A R20.1
N$11: D1.C Q1.3(D)
N$12: R13.2 R19.1 U3.4(FB)
N$13: C8.2 R14.2
N$14: D2.A R22.1
N$15: D2.C Q2.3(D)
N$16: IC1.3(GND) R26.2
N$17: C25.1 IC1.2(A) R24.1 Y2.2(CRYSTAL_2)
N$18: C26.2 R27.1 Y2.1(CRYSTAL_1)
N$19: IC1.5(VCC) R25.1
N$20: IC3.3(A2) OPEN8_LORA.2
N$21: R32.1 S1.1(ON_1)
N$22: R33.1 S2.1(ON_1)
N$23: NRESET_OPEN8.2 S1.2(COM)
N$24: NRESET_SERV.2 S2.2(COM)
N$25: IC3.4(A3) OPEN8_LORA.4
N$26: IC3.5(A4) OPEN8_LORA.6
N$27: IC3.6(A5) OPEN8_LORA.8
N$29: IC4.3(A2) OPEN8_FLASH.2
N$30: R15.1 R16.2 U4.4(FB)
N$31: IC2.3(GND) R30.2
N$32: C7.2 R17.2
N$33: C27.1 IC2.2(A) R28.1 Y3.2(CRYSTAL_2)
N$34: C28.2 R31.1 Y3.1(CRYSTAL_1)
N$35: IC4.4(A3) OPEN8_FLASH.4
N$36: IC2.5(VCC) R29.1
N$37: IC4.5(A4) OPEN8_FLASH.6
N$38: IC4.6(A5) OPEN8_FLASH.8
N$40: IC11.4(A3) OPEN8_SPI.2
N$41: IC11.5(A4) OPEN8_SPI.4
N$42: IC11.6(A5) OPEN8_SPI.6
N$43: IC11.7(A6) OPEN8_SPI.8
N$45: R41.1 S4.1(ON_1)
N$46: D4.A R40.1
N$47: D4.C Q3.3(D)
N$48: OPEN8_SW.4 S4.2(COM)
N$50: R39.1 S3.1(ON_1)
N$51: OPEN8_SW.2 S3.2(COM)
N$52: IC6.1(A1) OPEN8_JTAG.2
N$53: IC6.3(A2) OPEN8_JTAG.4
N$54: IC6.4(A3) OPEN8_JTAG.6
N$55: IC6.5(A4) OPEN8_JTAG.8
N$56: IC6.6(A5) OPEN8_JTAG.10
N$57: IC6.7(A6) OPEN8_UART.2
N$58: IC6.8(A7) OPEN8_UART.4
N$59: IC5.3(A2) SERV_LORA.2
N$60: IC5.4(A3) SERV_LORA.4
N$61: D19.A R62.1
N$63: IC5.5(A4) SERV_LORA.6
N$64: IC5.6(A5) SERV_LORA.8
N$66: IC7.3(A2) SERV_FLASH.2
N$67: IC7.4(A3) SERV_FLASH.4
N$68: IC7.5(A4) SERV_FLASH.6
N$69: IC7.6(A5) SERV_FLASH.8
N$70: D19.C Q16.3(D)
N$71: D20.A R64.1
N$72: D20.C Q17.3(D)
N$73: D21.A R77.1
N$74: D21.C Q18.3(D)
N$75: D22.A R79.1
N$76: D22.C Q19.3(D)
N$78: IC8.3(A2) SERV_SPI.2
N$79: IC8.4(A3) SERV_SPI.4
N$80: IC8.5(A4) SERV_SPI.6
N$81: IC8.6(A5) SERV_SPI.8
N$83: IC10.1(A1) SERV_JTAG.2
N$84: IC10.3(A2) SERV_JTAG.4
N$85: IC10.4(A3) SERV_JTAG.6
N$86: IC10.5(A4) SERV_JTAG.8
N$87: IC10.6(A5) SERV_JTAG.10
N$88: IC10.7(A6) SERV_UART.2
N$89: IC10.8(A7) SERV_UART.4
N$91: D3.A R52.1
N$92: D3.C Q4.3(D)
N$93: R54.1 S5.1(ON_1)
N$94: S5.2(COM) SERV_SW.2
N$95: R55.1 S6.1(ON_1)
N$96: S6.2(COM) SERV_SW.4
N$97: D5.A R56.1
N$100: D5.C Q5.3(D)
OPEN8_FLASH_CIPO: FLASH_OPEN8.8 IC4.18(B2)
OPEN8_FLASH_COPI: FLASH_OPEN8.10 IC4.16(B4)
OPEN8_FLASH_CS: FLASH_OPEN8.12 IC4.17(B3)
OPEN8_FLASH_SCK: FLASH_OPEN8.6 IC4.15(B5)
OPEN8_JTAG_TCK: IC6.16(B4) JTAG_OPEN8.9
OPEN8_JTAG_TDI: IC6.20(B1) JTAG_OPEN8.5
OPEN8_JTAG_TDO: IC6.18(B2) JTAG_OPEN8.13
OPEN8_JTAG_TMS: IC6.15(B5) JTAG_OPEN8.7
OPEN8_JTAG_TRST: IC6.17(B3) JTAG_OPEN8.3
OPEN8_LED: OPEN8_LED.2 Q3.1(G) R48.2
OPEN8_LORA_CS: IC3.17(B3) LORA_OPEN8.P$5(NSS)
OPEN8_LORA_MISO: IC3.15(B5) LORA_OPEN8.P$2(MISO)
OPEN8_LORA_MOSI: IC3.16(B4) LORA_OPEN8.P$3(MOSI)
OPEN8_LORA_SCK: IC3.18(B2) LORA_OPEN8.P$4(SCK)
OPEN8_PROG_CS: IC11.16(B4) SPI_OPEN8_2.4
OPEN8_PROG_MISO: IC11.14(B6) SPI_OPEN8_2.3
OPEN8_PROG_MOSI: IC11.15(B5) SPI_OPEN8_2.2
OPEN8_PROG_SCK: IC11.17(B3) SPI_OPEN8_2.1
OPEN8_UART_RX: IC6.13(B7) USB-UART_OPEN8_1.2
OPEN8_UART_TX: IC6.14(B6) USB-UART_OPEN8_1.4
OUT_3V3: C4.1 POWER.1 R9.2 U2.5(OUT)
OUT_OPEN8: C7.1 POWER.7 R15.2 U4.5(OUT)
OUT_RAM: C10.1 POWER.11 R6.2 U5.5(OUT)
OUT_SERV: C2.1 POWER.9 R3.2 U1.5(OUT)
OUT_VDD: C8.1 POWER.5 R19.2 U3.5(OUT)
OUT_VDDO: C12.1 POWER.3 R18.2 U6.5(OUT)
SERV_FLASH_CIPO: FLASH_SERV.8 IC7.18(B2)
SERV_FLASH_COPI: FLASH_SERV.10 IC7.16(B4)
SERV_FLASH_CS: FLASH_SERV.12 IC7.17(B3)
SERV_FLASH_SCK: FLASH_SERV.6 IC7.15(B5)
SERV_JTAG_TCK: IC10.16(B4) JTAG_SERV.9
SERV_JTAG_TDI: IC10.17(B3) JTAG_SERV.5
SERV_JTAG_TDO: IC10.18(B2) JTAG_SERV.13
SERV_JTAG_TMS: IC10.15(B5) JTAG_SERV.7
SERV_JTAG_TRST: IC10.20(B1) JTAG_SERV.3
SERV_LED: Q4.1(G) R53.2 SERV_LED.2
SERV_LORA_CS: IC5.17(B3) LORA_SERV.P$5(NSS)
SERV_LORA_MISO: IC5.15(B5) LORA_SERV.P$2(MISO)
SERV_LORA_MOSI: IC5.16(B4) LORA_SERV.P$3(MOSI)
SERV_LORA_SCK: IC5.18(B2) LORA_SERV.P$4(SCK)
SERV_PROG_CS: IC8.17(B3) SPI_SERV_1.4
SERV_PROG_MISO: IC8.15(B5) SPI_SERV_1.3
SERV_PROG_MOSI: IC8.16(B4) SPI_SERV_1.2
SERV_PROG_SCK: IC8.18(B2) SPI_SERV_1.1
SERV_UART_RX: IC10.14(B6) USB-UART_SERV_1.2
SERV_UART_TX: IC10.13(B7) USB-UART_SERV_1.4
SMA_CLK: CLOCK.5 J4.5
VDD: C19.1 C20.1 POWER.6 Q1.1(G) R21.2 U$1.13 U$2.13 U$3.15 U$4.13
VDD_3V3: C21.1 C29.1 C31.1 C36.1 C37.1 C39.1 C41.1 C44.1 FLASH_OPEN8.1 FLASH_OPEN8.2 FLASH_SERV.1 FLASH_SERV.2 IC3.19(VCCB) IC4.19(VCCB) IC5.19(VCCB) IC6.19(VCCB) IC7.19(VCCB) IC8.19(VCCB) IC10.19(VCCB) IC11.19(VCCB) JTAG_OPEN8.1 JTAG_OPEN8.2 JTAG_SERV.1 JTAG_SERV.2 LORA_OPEN8.P$12(3.3V) LORA_SERV.P$12(3.3V) POWER.2 Q18.1(G) R20.2 R22.2 R25.2 R29.2 R32.2 R33.2 R34.1 R39.2 R40.2 R41.2 R52.2 R54.2 R55.2 R56.2 R62.2 R64.2 R77.2 R78.2 R79.2 USB-UART_OPEN8_1.3 USB-UART_SERV_1.3
VDD_5V: IN_3V3.1 IN_OPEN8.1 IN_RAM.1 IN_SERV.1 IN_VDD.1 IN_VDDO.1 Q5.1(G) R57.2 USB-UART_OPEN8_2.2 USB-UART_SERV_2.2
VDDO: C16.1 C17.1 C30.1 C32.1 C34.1 C35.1 C38.1 C40.1 C42.1 C43.1 IC3.2(VCCA) IC3.10(OE) IC4.2(VCCA) IC4.10(OE) IC5.2(VCCA) IC5.10(OE) IC6.2(VCCA) IC6.10(OE) IC7.2(VCCA) IC7.10(OE) IC8.2(VCCA) IC8.10(OE) IC10.2(VCCA) IC10.10(OE) IC11.2(VCCA) IC11.10(OE) POWER.4 Q19.1(G) R80.2 U$1.27 U$2.25 U$3.25 U$4.27
Unconnected: FLASH_OPEN8.5 FLASH_OPEN8.7 FLASH_OPEN8.9 FLASH_OPEN8.11 FLASH_SERV.5 FLASH_SERV.7 FLASH_SERV.9 FLASH_SERV.11 IC1.1(N.C.) IC2.1(N.C.) IC3.1(A1) IC3.7(A6) IC3.8(A7) IC3.9(A8) IC3.12(B8) IC3.13(B7) IC3.14(B6) IC3.20(B1) IC4.1(A1) IC4.7(A6) IC4.8(A7) IC4.9(A8) IC4.12(B8) IC4.13(B7) IC4.14(B6) IC4.20(B1) IC5.1(A1) IC5.7(A6) IC5.8(A7) IC5.9(A8) IC5.12(B8) IC5.13(B7) IC5.14(B6) IC5.20(B1) IC6.9(A8) IC6.12(B8) IC7.1(A1) IC7.7(A6) IC7.8(A7) IC7.9(A8) IC7.12(B8) IC7.13(B7) IC7.14(B6) IC7.20(B1) IC8.1(A1) IC8.7(A6) IC8.8(A7) IC8.9(A8) IC8.12(B8) IC8.13(B7) IC8.14(B6) IC8.20(B1) IC10.9(A8) IC10.12(B8) IC11.1(A1) IC11.3(A2) IC11.8(A7) IC11.9(A8) IC11.12(B8) IC11.13(B7) IC11.18(B2) IC11.20(B1) JTAG_OPEN8.11 JTAG_OPEN8.15 JTAG_OPEN8.17 JTAG_OPEN8.19 JTAG_SERV.11 JTAG_SERV.15 JTAG_SERV.17 JTAG_SERV.19 LORA_OPEN8.P$6(RESET) LORA_OPEN8.P$7(DIO5) LORA_OPEN8.P$9(DIO2) LORA_OPEN8.P$10(DIO1) LORA_OPEN8.P$11(DIO0) LORA_OPEN8.P$13(DIO4) LORA_OPEN8.P$14(DIO3) LORA_OPEN8.P$16(ANT) LORA_SERV.P$6(RESET) LORA_SERV.P$7(DIO5) LORA_SERV.P$9(DIO2) LORA_SERV.P$10(DIO1) LORA_SERV.P$11(DIO0) LORA_SERV.P$13(DIO4) LORA_SERV.P$14(DIO3) LORA_SERV.P$16(ANT) SPI_OPEN8_1.1 SPI_OPEN8_1.2 SPI_OPEN8_1.3 SPI_OPEN8_1.4 SPI_OPEN8_1.5 SPI_OPEN8_1.6 SPI_OPEN8_1.7 SPI_OPEN8_1.8 SPI_OPEN8_1.9 SPI_OPEN8_1.10 SPI_OPEN8_2.5 SPI_OPEN8_2.6 SPI_OPEN8_2.7 SPI_OPEN8_2.8 SPI_OPEN8_2.9 SPI_SERV_1.5 SPI_SERV_1.6 SPI_SERV_1.7 SPI_SERV_1.8 SPI_SERV_1.9 SPI_SERV_2.1 SPI_SERV_2.2 SPI_SERV_2.3 SPI_SERV_2.4 SPI_SERV_2.5 SPI_SERV_2.6 SPI_SERV_2.7 SPI_SERV_2.8 SPI_SERV_2.9 SPI_SERV_2.10 U$1.2 U$1.41 U$2.2 U$2.41 U$3.2 U$3.41 U$4.2 U$4.41 USB-UART_OPEN8_2.1 USB-UART_OPEN8_2.3 USB-UART_OPEN8_2.4 USB-UART_SERV_2.1 USB-UART_SERV_2.3 USB-UART_SERV_2.4

## Notes on the sheet
- Pin Connection
- MUX
- OPEN8_LORA
- SERV_LORA
- RESET
- OPEN8_FLASH | SERV_FLASH
- OPEN8_SPI
- SERV_SPI
- OPEN8_JTAG
- SERV_JTAG
- POWER
- SERV_UART
- OPEN8_SWITCH | SERV_SWITCH
- OPEN8_LED
- SERV_LED
- Mounting holes
- CLOCK GENERATOR
- SMA
- 32KHZ | 8MHZ

## Library data of the parts
C1 C3 C5 C6 C9 C11 = SparkFun-Capacitors:1.0UF: 1µF ceramic capacitors A capacitor is a passive two-terminal electrical component used to store electrical energy temporarily in an electric field.; PROD_ID: CAP-00868
C2 C4 C7 C8 C10 C12 = SparkFun-Capacitors:4.7UF: 4.7µF ceramic capacitors A capacitor is a passive two-terminal electrical component used to store electrical energy temporarily in an electric field.; PROD_ID: CAP-08280
C13 C14 C16 C19 C21 C23 C29-C32 C34-C44 = SparkFun-Capacitors:0.1UF: 0.1µF ceramic capacitors A capacitor is a passive two-terminal electrical component used to store electrical energy temporarily in an electric field.; PROD_ID: CAP-08604
C15 C17 C18 C20 C24 = SparkFun-Capacitors:10UF: 10.0µF ceramic capacitors A capacitor is a passive two-terminal electrical component used to store electrical energy temporarily in an electric field.; PROD_ID: CAP-11015
C25 C26 = SparkFun-Capacitors:22PF: 22pF ceramic capacitors A capacitor is a passive two-terminal electrical component used to store electrical energy temporarily in an electric field.; PROD_ID: CAP-07876; VALUE: 22pF
C27 C28 = SparkFun-Capacitors:22PF: 22pF ceramic capacitors A capacitor is a passive two-terminal electrical component used to store electrical energy temporarily in an electric field.; PROD_ID: CAP-07876
CLOCK GND = Connector:PINHD-2X3: PIN HEADER; CATEGORY: CONNECTOR; SUB-CATEGORY: PIN-HEADER
D1-D5 D19-D22 = SparkFun-LED:LED: LED (Generic) Standard schematic elements and footprints for 5mm, 3mm, 1206, and 0603 sized LEDs. Generic LEDs with no color specified.
FLASH_OPEN8 FLASH_SERV = Connector:PINHD-2X6: PIN HEADER; CATEGORY: CONNECTOR; SUB-CATEGORY: PIN-HEADER
H1-H4 = holes:MOUNT-HOLE: MOUNTING HOLE with drill center marker
IC1 IC2 = SamacSys_Parts:SN74LVC1GU04DBVR: Single Inverter Gate Source: Datasheet <http://www.ti.com/lit/ds/symlink/sn74lvc1gu04.pdf>; ARROW_PART_NUMBER: SN74LVC1GU04DBVR; ARROW_PRICE-STOCK: https://www.arrow.com/en/products/sn74lvc1gu04dbvr/texas-instruments?region=nac; DESCRIPTION: Single Inverter Gate; HEIGHT: 1.45mm; MANUFACTURER_NAME: Texas Instruments; MANUFACTURER_PART_NUMBER: SN74LVC1GU04DBVR; MOUSER_PART_NUMBER: 595-SN74LVC1GU04DBVR; MOUSER_PRICE-STOCK: https://www.mouser.co.uk/ProductDetail/Texas-Instruments/SN74LVC1GU04DBVR?qs=xJkDX%2FqrskOXGoPUy6IENA%3D%3D
IC3-IC8 IC10 IC11 = SamacSys_Parts:TXB0108PWR: 8-Bit Bidirectional Voltage-Level Shifter with Auto Direction Sensing and +/-15-kV ESD Protect Source: Datasheet <http://www.ti.com/lit/ds/symlink/txb0108.pdf>; ARROW_PART_NUMBER: TXB0108PWR; ARROW_PRICE-STOCK: https://www.arrow.com/en/products/txb0108pwr/texas-instruments?region=nac; DESCRIPTION: 8-Bit Bidirectional Voltage-Level Shifter with Auto Direction Sensing and +/-15-kV ESD Protect; HEIGHT: 1.2mm; MANUFACTURER_NAME: Texas Instruments; MANUFACTURER_PART_NUMBER: TXB0108PWR; MOUSER_PART_NUMBER: 595-TXB0108PWR; MOUSER_PRICE-STOCK: https://www.mouser.co.uk/ProductDetail/Texas-Instruments/TXB0108PWR?qs=oFXvjAmG9EgEUWGWzOVFCA%3D%3D
IN_3V3 IN_OPEN8 IN_RAM IN_SERV IN_VDD IN_VDDO NRESET_OPEN8 NRESET_SERV = jumper:JP1Q: JUMPER
J4 = SamacSys_Parts:2985-6004: RF Connectors / Coaxial Connectors SMA F PCB Thru-Hole Conn, 50-OHMS 1000 Source: Datasheet <https://componentsearchengine.com//2985-6004.pdf>; DESCRIPTION: RF Connectors / Coaxial Connectors SMA F PCB Thru-Hole Conn, 50-OHMS 1000; HEIGHT: 9.54mm; MANUFACTURER_NAME: Amphenol; MANUFACTURER_PART_NUMBER: 2985-6004; MOUSER_PART_NUMBER: 523-2985-6004; MOUSER_PRICE-STOCK: https://www.mouser.co.uk/ProductDetail/Amphenol-SV-Microwave/2985-6004?qs=jyo2EwfRkUNkt8LGijRXFQ%3D%3D
JTAG_OPEN8 JTAG_SERV = pinhead:PINHD-2X10: PIN HEADER
LORA_OPEN8 LORA_SERV = qfp160:RFM95W-915S2
MUX = pinhead:PINHD-1X2: PIN HEADER
OPEN8_FLASH OPEN8_LORA OPEN8_SPI SERV_FLASH SERV_LORA SERV_SPI = pinhead:PINHD-2X4: PIN HEADER
OPEN8_JTAG SERV_JTAG = Connector:PINHD-2X5: PIN HEADER; CATEGORY: CONNECTOR; SUB-CATEGORY: PIN-HEADER
OPEN8_LED SERV_LED = Connector:PINHD-1X2: PIN HEADER; CATEGORY: CONNECTOR; SUB-CATEGORY: PIN-HEADER
OPEN8_SW OPEN8_UART SERV_SW SERV_UART = Connector:PINHD-2X2: PIN HEADER; CATEGORY: CONNECTOR; SUB-CATEGORY: PIN-HEADER
POWER = pinhead:PINHD-2X6: PIN HEADER
Q1-Q5 Q16-Q19 = SamacSys_Parts:BSH103,235: MOSFET TAPE13 MOSFET Source: Datasheet <http://www.nxp.com/documents/data_sheet/BSH103.pdf>; DESCRIPTION: MOSFET TAPE13 MOSFET; HEIGHT: 1.1mm; MANUFACTURER_NAME: Nexperia; MANUFACTURER_PART_NUMBER: BSH103,235; MOUSER_PART_NUMBER: 771-BSH103235; MOUSER_PRICE-STOCK: https://www.mouser.co.uk/ProductDetail/Nexperia/BSH103235?qs=me8TqzrmIYVhbJIwsR7ziw%3D%3D
R1 R4 R7 R11 R13 R16 = SparkFun-Resistors:62KOHM: 62kΩ resistor A resistor is a passive two-terminal electrical component that implements electrical resistance as a circuit element. Resistors act to reduce current flow, and, at the same time, act to lower voltage levels within circuits. - Wikipedia
R2 R5 R8 R12 R14 R17 = SparkFun-Resistors:1OHM: 1Ω resistor A resistor is a passive two-terminal electrical component that implements electrical resistance as a circuit element. Resistors act to reduce current flow, and, at the same time, act to lower voltage levels within circuits. - Wikipedia; PROD_ID: RES-08269
R3 R6 R15 R18 R19 = SparkFun-Resistors:43KOHM: 43kΩ resistor A resistor is a passive two-terminal electrical component that implements electrical resistance as a circuit element. Resistors act to reduce current flow, and, at the same time, act to lower voltage levels within circuits. - Wikipedia; PROD_ID: RES-07858; VALUE: 43k
R9 = SparkFun-Resistors:26.7KOHM: 26.7kΩ resistor A resistor is a passive two-terminal electrical component that implements electrical resistance as a circuit element. Resistors act to reduce current flow, and, at the same time, act to lower voltage levels within circuits. - Wikipedia; PROD_ID: RES-12186; VALUE: 26.7k
R10 = SparkFun-Resistors:220KOHM: 220kΩ resistor A resistor is a passive two-terminal electrical component that implements electrical resistance as a circuit element. Resistors act to reduce current flow, and, at the same time, act to lower voltage levels within circuits. - Wikipedia; PROD_ID: RES-08969; VALUE: 220k
R20 R22 R40 R52 R56 R62 R64 R77 R79 = SparkFun-Resistors:330OHM: 330Ω resistor A resistor is a passive two-terminal electrical component that implements electrical resistance as a circuit element. Resistors act to reduce current flow, and, at the same time, act to lower voltage levels within circuits. - Wikipedia; PROD_ID: RES-00818
R21 R23 R32-R34 R39 R41 R48 R53-R55 R57 R63 R65 R78 R80 = SparkFun-Resistors:10KOHM: 10kΩ resistor A resistor is a passive two-terminal electrical component that implements electrical resistance as a circuit element. Resistors act to reduce current flow, and, at the same time, act to lower voltage levels within circuits. - Wikipedia; PROD_ID: RES-00824
R24-R31 = SparkFun-Resistors:22MOHM: 22MΩ resistor A resistor is a passive two-terminal electrical component that implements electrical resistance as a circuit element. Resistors act to reduce current flow, and, at the same time, act to lower voltage levels within circuits. - Wikipedia; PROD_ID: RES-11132; VALUE: 22M
S1-S6 = SamacSys_Parts:SS12SDP2: Switch, Slide,Sub Miniature,Top Actuated,SPDT, On-none-On Source: Datasheet; DESCRIPTION: Switch, Slide,Sub Miniature,Top Actuated,SPDT, On-none-On; HEIGHT: 4mm; MANUFACTURER_NAME: NKK Switches; MANUFACTURER_PART_NUMBER: SS12SDP2; MOUSER_PART_NUMBER: 633-SS12SDP2; MOUSER_PRICE-STOCK: https://www.mouser.co.uk/ProductDetail/NKK-Switches/SS12SDP2?qs=Av7JdS0MGqKsG%252BWOKKtU2w%3D%3D
SPI_OPEN8_1 SPI_OPEN8_2 SPI_SERV_1 SPI_SERV_2 = con-lsta:FE10-1: FEMALE HEADER; OC_FARNELL: unknown; OC_NEWARK: unknown
U1-U6 = TPS76201DBVR:TPS76201DBVR: Check prices <https://pricing.snapeda.com/parts/TPS76201DBVR/Texas%20Instruments/view-part?ref=eda>; AVAILABILITY: In Stock; DESCRIPTION: 100-mA, 10-V, low-IQ, adjustable low-dropout voltage regulator with enable 5-SOT-23 -40 to 125; MF: Texas Instruments; MP: TPS76201DBVR; PACKAGE: SOT-23-5 Texas Instruments; PRICE: None; PURCHASE-URL: https://pricing.snapeda.com/search/part/TPS76201DBVR/?ref=eda
U$1-U$4 = Duy:2X41_HEADER
USB-UART_OPEN8_1 USB-UART_OPEN8_2 USB-UART_SERV_1 USB-UART_SERV_2 = Connector:PINHD-1X4: PIN HEADER; CATEGORY: CONNECTOR; SUB-CATEGORY: PIN-HEADER
Y2 = SamacSys_Parts:HC-49SM8MHZ20PF30PPM: Crystal Source: Datasheet <https://datasheet.lcsc.com/szlcsc/Zhejiang-Abel-Elec-HC-49SM8MHz20pF30ppm_C107426.pdf>; DESCRIPTION: Crystal; HEIGHT: 4mm; MANUFACTURER_NAME: TAE(Zhejiang Abel Elec); MANUFACTURER_PART_NUMBER: HC-49SM8MHz20pF30ppm
Y3 = SamacSys_Parts:Q13FC1350000400: SMD Crystal Resonators 32.768KHz +/-20ppm SMD-3215_2P RoHS Source: Datasheet <https://datasheet.lcsc.com/szlcsc/1901081604_Seiko-Epson-Q13FC1350000400_C32346.pdf>; DESCRIPTION: SMD Crystal Resonators 32.768KHz +/-20ppm SMD-3215_2P RoHS; HEIGHT: 0.9mm; MANUFACTURER_NAME: SEIKO EPSON; MANUFACTURER_PART_NUMBER: Q13FC1350000400